# Altium project ArtixDuo.PrjPcb (part 7 of 8)

## Sheet High Speed User IO.SchDoc
size A2; SheetNumber: 12; SheetTotal: 13
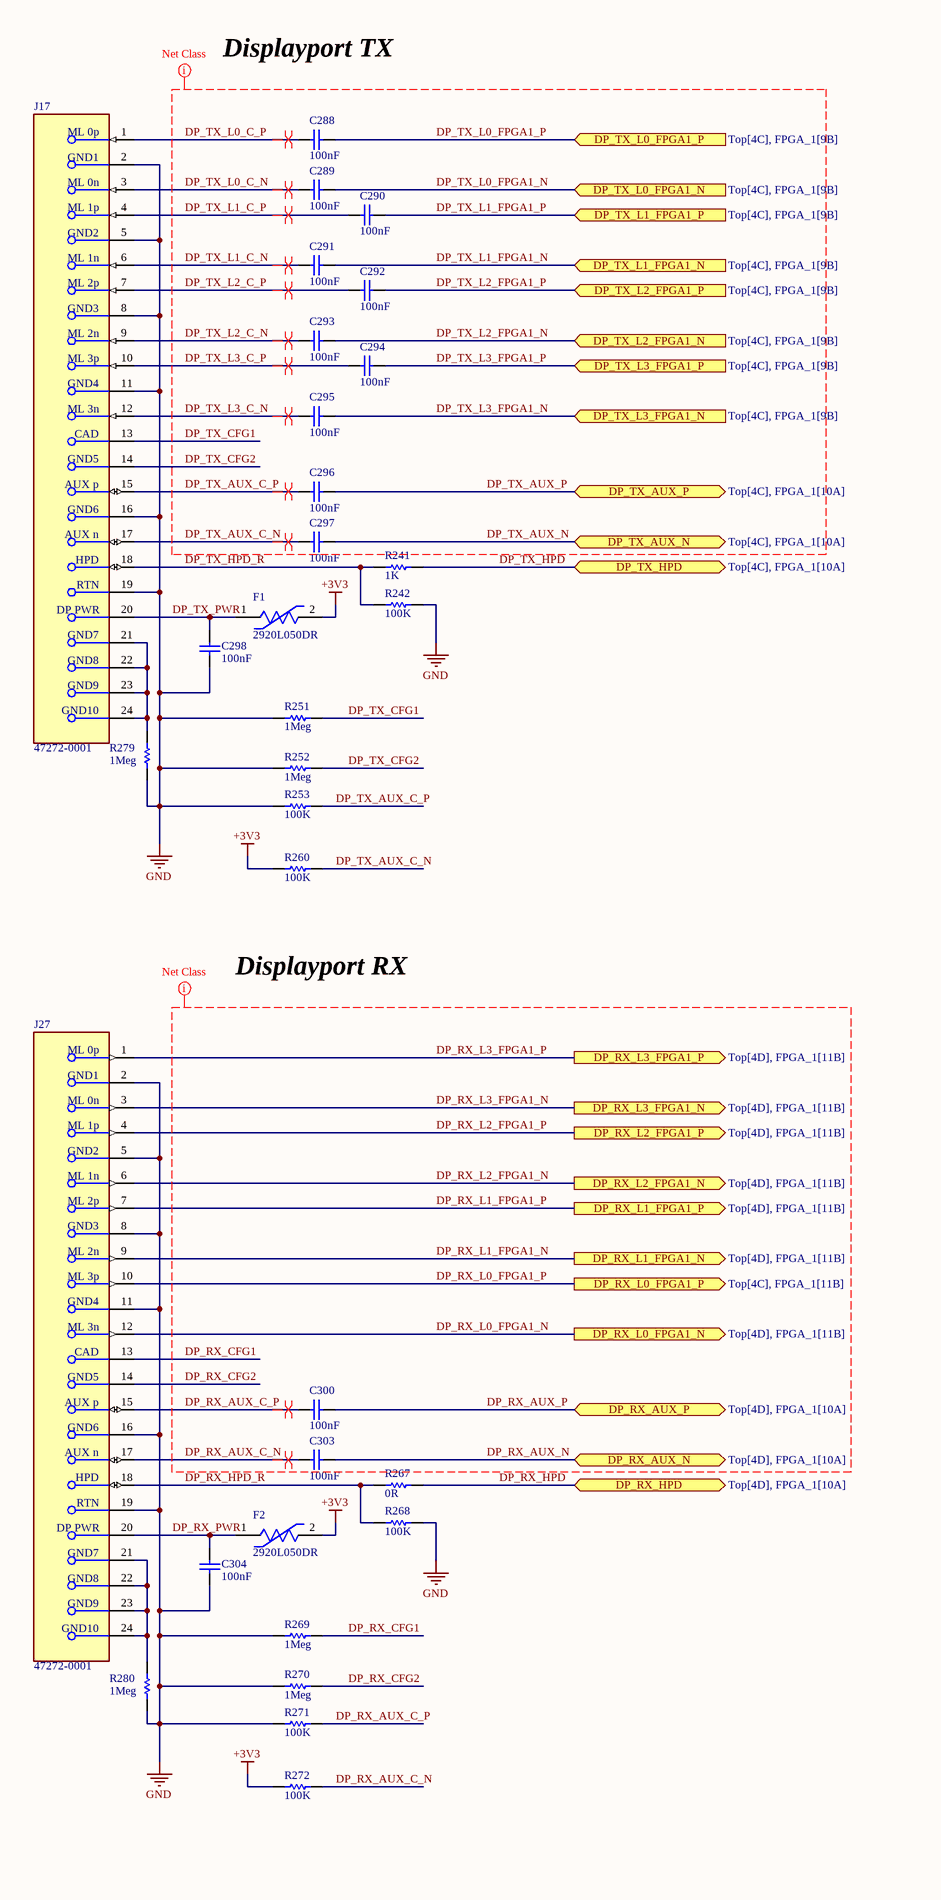
[diagram p26: High Speed User IO.SchDoc, left]
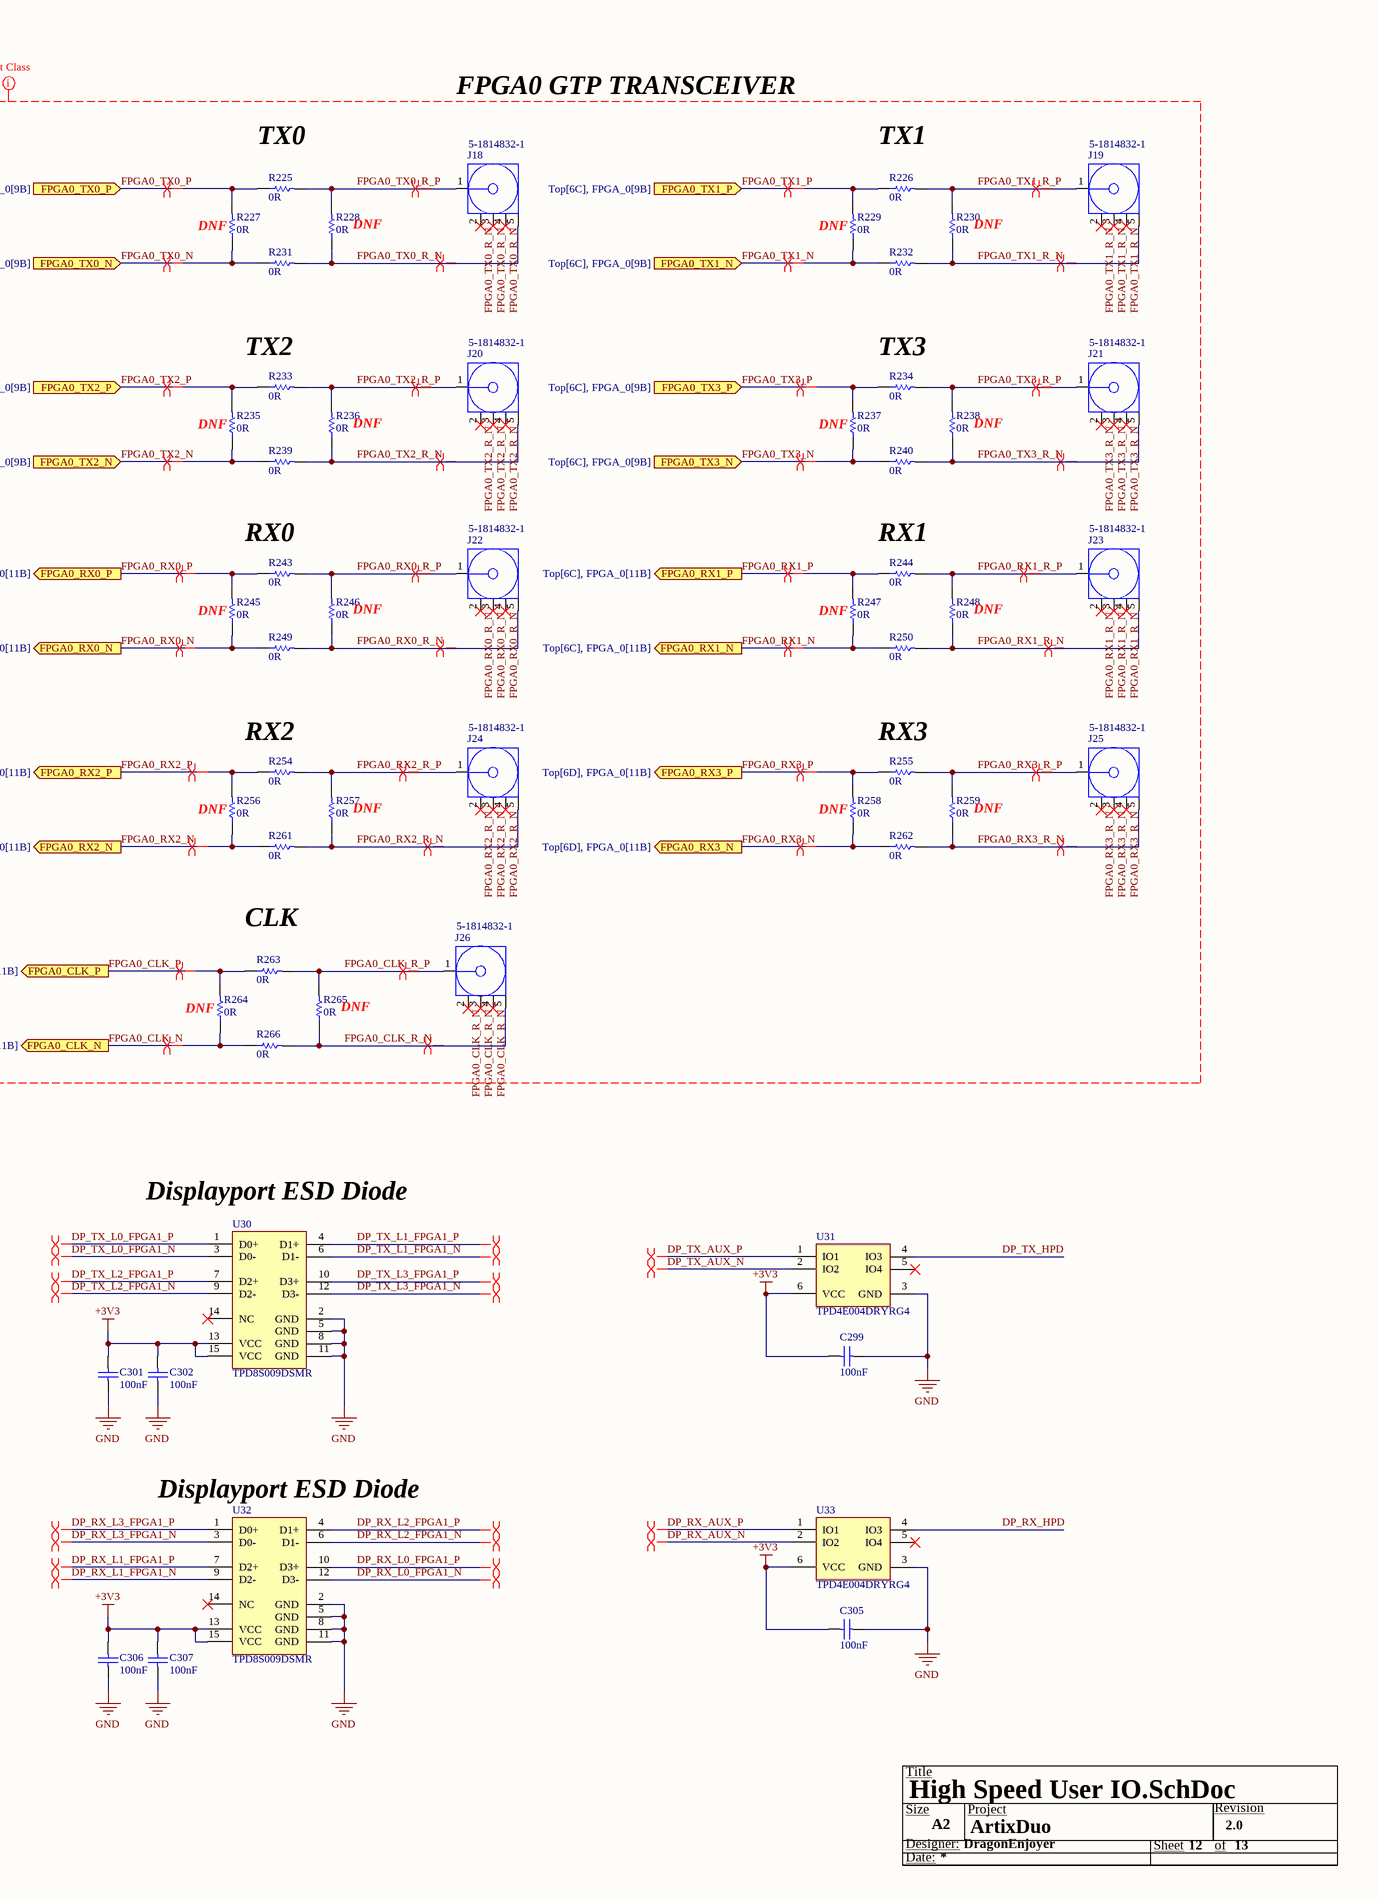
[diagram p27: High Speed User IO.SchDoc, right]

### Parts
(Parts that share a designator on the sheet are numbered #1, #2 ... from top to bottom, then left to right.)
*#10  Size: A2  (hidden comment: Title Block)  (graphical)
C288  100nF  [CAPC1005X05N]
C289  100nF  [CAPC1005X05N]
C290  100nF  [CAPC1005X05N]
C291  100nF  [CAPC1005X05N]
C292  100nF  [CAPC1005X05N]
C293  100nF  [CAPC1005X05N]
C294  100nF  [CAPC1005X05N]
C295  100nF  [CAPC1005X05N]
C296  100nF  [CAPC1005X05N]
C297  100nF  [CAPC1005X05N]
C298  100nF  [CAPC1005X05N]
C299  100nF  [CAPC1005X05N]
C300  100nF  [CAPC1005X05N]
C301  100nF  [CAPC1005X05N]
C302  100nF  [CAPC1005X05N]
C303  100nF  [CAPC1005X05N]
C304  100nF  [CAPC1005X05N]
C305  100nF  [CAPC1005X05N]
C306  100nF  [CAPC1005X05N]
C307  100nF  [CAPC1005X05N]
F1  2920L050DR  [FP-2920L050DR-MFG]
F2  2920L050DR  [FP-2920L050DR-MFG]
J17  47272-0001  [FP-47272-0001-MFG]
J18  5-1814832-1  [TECO-5-1814832-1_V]
J19  5-1814832-1  [TECO-5-1814832-1_V]
J20  5-1814832-1  [TECO-5-1814832-1_V]
J21  5-1814832-1  [TECO-5-1814832-1_V]
J22  5-1814832-1  [TECO-5-1814832-1_V]
J23  5-1814832-1  [TECO-5-1814832-1_V]
J24  5-1814832-1  [TECO-5-1814832-1_V]
J25  5-1814832-1  [TECO-5-1814832-1_V]
J26  5-1814832-1  [TECO-5-1814832-1_V]
J27  47272-0001  [FP-47272-0001-MFG]
R225  0R  [RESC1005X40X25NL05T10]
R226  0R  [RESC1005X40X25NL05T10]
R227  0R  [RESC1005X40X25NL05T10]
R228  0R  [RESC1005X40X25NL05T10]
R229  0R  [RESC1005X40X25NL05T10]
R230  0R  [RESC1005X40X25NL05T10]
R231  0R  [RESC1005X40X25NL05T10]
R232  0R  [RESC1005X40X25NL05T10]
R233  0R  [RESC1005X40X25NL05T10]
R234  0R  [RESC1005X40X25NL05T10]
R235  0R  [RESC1005X40X25NL05T10]
R236  0R  [RESC1005X40X25NL05T10]
R237  0R  [RESC1005X40X25NL05T10]
R238  0R  [RESC1005X40X25NL05T10]
R239  0R  [RESC1005X40X25NL05T10]
R240  0R  [RESC1005X40X25NL05T10]
R241  1K  [RESC1005X40X25NL05T10]
R242  100K  [RESC1005X40X25NL05T05]
R243  0R  [RESC1005X40X25NL05T10]
R244  0R  [RESC1005X40X25NL05T10]
R245  0R  [RESC1005X40X25NL05T10]
R246  0R  [RESC1005X40X25NL05T10]
R247  0R  [RESC1005X40X25NL05T10]
R248  0R  [RESC1005X40X25NL05T10]
R249  0R  [RESC1005X40X25NL05T10]
R250  0R  [RESC1005X40X25NL05T10]
R251  1Meg  [RESC1005X40X25NL05T05]
R252  1Meg  [RESC1005X40X25NL05T05]
R253  100K  [RESC1005X40X25NL05T05]
R254  0R  [RESC1005X40X25NL05T10]
R255  0R  [RESC1005X40X25NL05T10]
R256  0R  [RESC1005X40X25NL05T10]
R257  0R  [RESC1005X40X25NL05T10]
R258  0R  [RESC1005X40X25NL05T10]
R259  0R  [RESC1005X40X25NL05T10]
R260  100K  [RESC1005X40X25NL05T05]
R261  0R  [RESC1005X40X25NL05T10]
R262  0R  [RESC1005X40X25NL05T10]
R263  0R  [RESC1005X40X25NL05T10]
R264  0R  [RESC1005X40X25NL05T10]
R265  0R  [RESC1005X40X25NL05T10]
R266  0R  [RESC1005X40X25NL05T10]
R267  0R  [RESC1005X40X25NL05T10]
R268  100K  [RESC1005X40X25NL05T05]
R269  1Meg  [RESC1005X40X25NL05T05]
R270  1Meg  [RESC1005X40X25NL05T05]
R271  100K  [RESC1005X40X25NL05T05]
R272  100K  [RESC1005X40X25NL05T05]
R279  1Meg  [RESC1005X40X25NL05T05]
R280  1Meg  [RESC1005X40X25NL05T05]
U30  TPD8S009DSMR  [DSM0015A_V]
U31  TPD4E004DRYRG4  [DRY0006A]
U32  TPD8S009DSMR  [DSM0015A_V]
U33  TPD4E004DRYRG4  [DRY0006A]

### Ports
DP_RX_AUX_N (bidir, see Top[4D], FPGA_1[10A]), DP_RX_AUX_P (bidir, see Top[4D], FPGA_1[10A]), DP_RX_HPD (bidir, see Top[4D], FPGA_1[10A]), DP_RX_L0_FPGA1_N (out, see Top[4D], FPGA_1[11B]), DP_RX_L0_FPGA1_P (out, see Top[4C], FPGA_1[11B]), DP_RX_L1_FPGA1_N (out, see Top[4D], FPGA_1[11B]), DP_RX_L1_FPGA1_P (out, see Top[4D], FPGA_1[11B]), DP_RX_L2_FPGA1_N (out, see Top[4D], FPGA_1[11B]), DP_RX_L2_FPGA1_P (out, see Top[4D], FPGA_1[11B]), DP_RX_L3_FPGA1_N (out, see Top[4D], FPGA_1[11B]), DP_RX_L3_FPGA1_P (out, see Top[4D], FPGA_1[11B]), DP_TX_AUX_N (bidir, see Top[4C], FPGA_1[10A]), DP_TX_AUX_P (bidir, see Top[4C], FPGA_1[10A]), DP_TX_HPD (bidir, see Top[4C], FPGA_1[10A]), DP_TX_L0_FPGA1_N (in, see Top[4C], FPGA_1[9B]), DP_TX_L0_FPGA1_P (in, see Top[4C], FPGA_1[9B]), DP_TX_L1_FPGA1_N (in, see Top[4C], FPGA_1[9B]), DP_TX_L1_FPGA1_P (in, see Top[4C], FPGA_1[9B]), DP_TX_L2_FPGA1_N (in, see Top[4C], FPGA_1[9B]), DP_TX_L2_FPGA1_P (in, see Top[4C], FPGA_1[9B]), DP_TX_L3_FPGA1_N (in, see Top[4C], FPGA_1[9B]), DP_TX_L3_FPGA1_P (in, see Top[4C], FPGA_1[9B]), FPGA0_CLK_N (out, see Top[6D], FPGA_0[11B]), FPGA0_CLK_P (out, see Top[6D], FPGA_0[11B]), FPGA0_RX0_N (out, see Top[6C], FPGA_0[11B]), FPGA0_RX0_P (out, see Top[6C], FPGA_0[11B]), FPGA0_RX1_N (out, see Top[6C], FPGA_0[11B]), FPGA0_RX1_P (out, see Top[6C], FPGA_0[11B]), FPGA0_RX2_N (out, see Top[6D], FPGA_0[11B]), FPGA0_RX2_P (out, see Top[6C], FPGA_0[11B]), FPGA0_RX3_N (out, see Top[6D], FPGA_0[11B]), FPGA0_RX3_P (out, see Top[6D], FPGA_0[11B]), FPGA0_TX0_N (in, see Top[6C], FPGA_0[9B]), FPGA0_TX0_P (in, see Top[6C], FPGA_0[9B]), FPGA0_TX1_N (in, see Top[6C], FPGA_0[9B]), FPGA0_TX1_P (in, see Top[6C], FPGA_0[9B]), FPGA0_TX2_N (in, see Top[6C], FPGA_0[9B]), FPGA0_TX2_P (in, see Top[6C], FPGA_0[9B]), FPGA0_TX3_N (in, see Top[6C], FPGA_0[9B]), FPGA0_TX3_P (in, see Top[6C], FPGA_0[9B])

### Nets
+3V3: C299.1 C301.1 C302.1 C305.1 C306.1 C307.1 F1.2 F2.2 R260.1 R272.1 U30.13(VCC) U30.15(VCC) U31.6(VCC) U32.13(VCC) U32.15(VCC) U33.6(VCC)
GND: C298.2 C299.2 C301.2 C302.2 C304.2 C305.2 C306.2 C307.2 J17.2(GND1) J17.5(GND2) J17.8(GND3) J17.11(GND4) J17.16(GND6) J17.19(RTN) J27.2(GND1) J27.5(GND2) J27.8(GND3) J27.11(GND4) J27.16(GND6) J27.19(RTN) R242.2 R251.1 R252.1 R253.1 R268.2 R269.1 R270.1 R271.1 R279.2 R280.1 U30.2(GND) U30.5(GND) U30.8(GND) U30.11(GND) U31.3(GND) U32.2(GND) U32.5(GND) U32.8(GND) U32.11(GND) U33.3(GND)
DP_RX_AUX_C_N: C303.2 J27.17(AUX_n) R272.2
DP_RX_AUX_C_P: C300.2 J27.15(AUX_p) R271.2
DP_RX_AUX_N: C303.1 U33.2(IO2) ; port DP_RX_AUX_N
DP_RX_AUX_P: C300.1 U33.1(IO1) ; port DP_RX_AUX_P
DP_RX_CFG1: J27.13(CAD) R269.2
DP_RX_CFG2: J27.14(GND5) R270.2
DP_RX_HPD: R267.2 U33.4(IO3) ; port DP_RX_HPD
DP_RX_HPD_R: J27.18(HPD) R267.1 R268.1
DP_RX_L0_FPGA1_N: J27.12(ML_3n) U32.12(D3-) ; port DP_RX_L0_FPGA1_N
DP_RX_L0_FPGA1_P: J27.10(ML_3p) U32.10(D3+) ; port DP_RX_L0_FPGA1_P
DP_RX_L1_FPGA1_N: J27.9(ML_2n) U32.9(D2-) ; port DP_RX_L1_FPGA1_N
DP_RX_L1_FPGA1_P: J27.7(ML_2p) U32.7(D2+) ; port DP_RX_L1_FPGA1_P
DP_RX_L2_FPGA1_N: J27.6(ML_1n) U32.6(D1-) ; port DP_RX_L2_FPGA1_N
DP_RX_L2_FPGA1_P: J27.4(ML_1p) U32.4(D1+) ; port DP_RX_L2_FPGA1_P
DP_RX_L3_FPGA1_N: J27.3(ML_0n) U32.3(D0-) ; port DP_RX_L3_FPGA1_N
DP_RX_L3_FPGA1_P: J27.1(ML_0p) U32.1(D0+) ; port DP_RX_L3_FPGA1_P
DP_RX_PWR: C304.1 F2.1 J27.20(DP_PWR)
DP_TX_AUX_C_N: C297.2 J17.17(AUX_n) R260.2
DP_TX_AUX_C_P: C296.2 J17.15(AUX_p) R253.2
DP_TX_AUX_N: C297.1 U31.2(IO2) ; port DP_TX_AUX_N
DP_TX_AUX_P: C296.1 U31.1(IO1) ; port DP_TX_AUX_P
DP_TX_CFG1: J17.13(CAD) R251.2
DP_TX_CFG2: J17.14(GND5) R252.2
DP_TX_HPD: R241.2 U31.4(IO3) ; port DP_TX_HPD
DP_TX_HPD_R: J17.18(HPD) R241.1 R242.1
DP_TX_L0_C_N: C289.2 J17.3(ML_0n)
DP_TX_L0_C_P: C288.2 J17.1(ML_0p)
DP_TX_L0_FPGA1_N: C289.1 U30.3(D0-) ; port DP_TX_L0_FPGA1_N
DP_TX_L0_FPGA1_P: C288.1 U30.1(D0+) ; port DP_TX_L0_FPGA1_P
DP_TX_L1_C_N: C291.2 J17.6(ML_1n)
DP_TX_L1_C_P: C290.2 J17.4(ML_1p)
DP_TX_L1_FPGA1_N: C291.1 U30.6(D1-) ; port DP_TX_L1_FPGA1_N
DP_TX_L1_FPGA1_P: C290.1 U30.4(D1+) ; port DP_TX_L1_FPGA1_P
DP_TX_L2_C_N: C293.2 J17.9(ML_2n)
DP_TX_L2_C_P: C292.2 J17.7(ML_2p)
DP_TX_L2_FPGA1_N: C293.1 U30.9(D2-) ; port DP_TX_L2_FPGA1_N
DP_TX_L2_FPGA1_P: C292.1 U30.7(D2+) ; port DP_TX_L2_FPGA1_P
DP_TX_L3_C_N: C295.2 J17.12(ML_3n)
DP_TX_L3_C_P: C294.2 J17.10(ML_3p)
DP_TX_L3_FPGA1_N: C295.1 U30.12(D3-) ; port DP_TX_L3_FPGA1_N
DP_TX_L3_FPGA1_P: C294.1 U30.10(D3+) ; port DP_TX_L3_FPGA1_P
DP_TX_PWR: C298.1 F1.1 J17.20(DP_PWR)
FPGA0_CLK_N: R264.1 R266.1 ; port FPGA0_CLK_N
FPGA0_CLK_P: R263.1 R264.2 ; port FPGA0_CLK_P
FPGA0_CLK_R_N: J26.2 J26.3 J26.4 J26.5 R265.1 R266.2
FPGA0_CLK_R_P: J26.1 R263.2 R265.2
FPGA0_RX0_N: R245.1 R249.1 ; port FPGA0_RX0_N
FPGA0_RX0_P: R243.1 R245.2 ; port FPGA0_RX0_P
FPGA0_RX0_R_N: J22.2 J22.3 J22.4 J22.5 R246.1 R249.2
FPGA0_RX0_R_P: J22.1 R243.2 R246.2
FPGA0_RX1_N: R247.1 R250.1 ; port FPGA0_RX1_N
FPGA0_RX1_P: R244.1 R247.2 ; port FPGA0_RX1_P
FPGA0_RX1_R_N: J23.2 J23.3 J23.4 J23.5 R248.1 R250.2
FPGA0_RX1_R_P: J23.1 R244.2 R248.2
FPGA0_RX2_N: R256.1 R261.1 ; port FPGA0_RX2_N
FPGA0_RX2_P: R254.1 R256.2 ; port FPGA0_RX2_P
FPGA0_RX2_R_N: J24.2 J24.3 J24.4 J24.5 R257.1 R261.2
FPGA0_RX2_R_P: J24.1 R254.2 R257.2
FPGA0_RX3_N: R258.1 R262.1 ; port FPGA0_RX3_N
FPGA0_RX3_P: R255.1 R258.2 ; port FPGA0_RX3_P
FPGA0_RX3_R_N: J25.2 J25.3 J25.4 J25.5 R259.1 R262.2
FPGA0_RX3_R_P: J25.1 R255.2 R259.2
FPGA0_TX0_N: R227.1 R231.1 ; port FPGA0_TX0_N
FPGA0_TX0_P: R225.1 R227.2 ; port FPGA0_TX0_P
FPGA0_TX0_R_N: J18.2 J18.3 J18.4 J18.5 R228.1 R231.2
FPGA0_TX0_R_P: J18.1 R225.2 R228.2
FPGA0_TX1_N: R229.1 R232.1 ; port FPGA0_TX1_N
FPGA0_TX1_P: R226.1 R229.2 ; port FPGA0_TX1_P
FPGA0_TX1_R_N: J19.2 J19.3 J19.4 J19.5 R230.1 R232.2
FPGA0_TX1_R_P: J19.1 R226.2 R230.2
FPGA0_TX2_N: R235.1 R239.1 ; port FPGA0_TX2_N
FPGA0_TX2_P: R233.1 R235.2 ; port FPGA0_TX2_P
FPGA0_TX2_R_N: J20.2 J20.3 J20.4 J20.5 R236.1 R239.2
FPGA0_TX2_R_P: J20.1 R233.2 R236.2
FPGA0_TX3_N: R237.1 R240.1 ; port FPGA0_TX3_N
FPGA0_TX3_P: R234.1 R237.2 ; port FPGA0_TX3_P
FPGA0_TX3_R_N: J21.2 J21.3 J21.4 J21.5 R238.1 R240.2
FPGA0_TX3_R_P: J21.1 R234.2 R238.2
NetJ17_21: J17.21(GND7) J17.22(GND8) J17.23(GND9) J17.24(GND10) R279.1
NetJ27_21: J27.21(GND7) J27.22(GND8) J27.23(GND9) J27.24(GND10) R280.2

Not connected (* = marked no-connect by the designer): U30 14(NC)*; U31 5(IO4)*; U32 14(NC)*; U33 5(IO4)*

### Layout directives
net class FPGA1 DP RX: DP_RX_AUX_C_N, DP_RX_AUX_C_P, DP_RX_AUX_N, DP_RX_AUX_P, DP_RX_CFG1, DP_RX_CFG2, DP_RX_L0_FPGA1_N, DP_RX_L0_FPGA1_P, DP_RX_L1_FPGA1_N, DP_RX_L1_FPGA1_P, DP_RX_L2_FPGA1_N, DP_RX_L2_FPGA1_P, DP_RX_L3_FPGA1_N, DP_RX_L3_FPGA1_P
net class FPGA1 DP TX: DP_TX_AUX_C_N, DP_TX_AUX_C_P, DP_TX_AUX_N, DP_TX_AUX_P, DP_TX_CFG1, DP_TX_CFG2, DP_TX_L0_C_N, DP_TX_L0_C_P, DP_TX_L0_FPGA1_N, DP_TX_L0_FPGA1_P, DP_TX_L1_C_N, DP_TX_L1_C_P, DP_TX_L1_FPGA1_N, DP_TX_L1_FPGA1_P, DP_TX_L2_C_N, DP_TX_L2_C_P, DP_TX_L2_FPGA1_N, DP_TX_L2_FPGA1_P, DP_TX_L3_C_N, DP_TX_L3_C_P, DP_TX_L3_FPGA1_N, DP_TX_L3_FPGA1_P
net class FPGA1 GPT TRANSCEIVERS: FPGA0_CLK_N, FPGA0_CLK_P, FPGA0_CLK_R_N, FPGA0_CLK_R_P, FPGA0_RX0_N, FPGA0_RX0_P, FPGA0_RX0_R_N, FPGA0_RX0_R_P, FPGA0_RX1_N, FPGA0_RX1_P, FPGA0_RX1_R_N, FPGA0_RX1_R_P, FPGA0_RX2_N, FPGA0_RX2_P, FPGA0_RX2_R_N, FPGA0_RX2_R_P, FPGA0_RX3_N, FPGA0_RX3_P, FPGA0_RX3_R_N, FPGA0_RX3_R_P, FPGA0_TX0_N, FPGA0_TX0_P, FPGA0_TX0_R_N, FPGA0_TX0_R_P, FPGA0_TX1_N, FPGA0_TX1_P, FPGA0_TX1_R_N, FPGA0_TX1_R_P, FPGA0_TX2_N, FPGA0_TX2_P, FPGA0_TX2_R_N, FPGA0_TX2_R_P, FPGA0_TX3_N, FPGA0_TX3_P, FPGA0_TX3_R_N, FPGA0_TX3_R_P
differential pair: DP_RX_AUX_C_N, DP_RX_AUX_C_P, DP_RX_AUX_N, DP_RX_AUX_P, DP_RX_L0_FPGA1_N, DP_RX_L0_FPGA1_P, DP_RX_L1_FPGA1_N, DP_RX_L1_FPGA1_P, DP_RX_L2_FPGA1_N, DP_RX_L2_FPGA1_P, DP_RX_L3_FPGA1_N, DP_RX_L3_FPGA1_P, DP_TX_AUX_C_N, DP_TX_AUX_C_P, DP_TX_AUX_N, DP_TX_AUX_P, DP_TX_L0_C_N, DP_TX_L0_C_P, DP_TX_L0_FPGA1_N, DP_TX_L0_FPGA1_P, DP_TX_L1_C_N, DP_TX_L1_C_P, DP_TX_L1_FPGA1_N, DP_TX_L1_FPGA1_P, DP_TX_L2_C_N, DP_TX_L2_C_P, DP_TX_L2_FPGA1_N, DP_TX_L2_FPGA1_P, DP_TX_L3_C_N, DP_TX_L3_C_P, DP_TX_L3_FPGA1_N, DP_TX_L3_FPGA1_P, FPGA0_CLK_N, FPGA0_CLK_P, FPGA0_CLK_R_N, FPGA0_CLK_R_P, FPGA0_RX0_N, FPGA0_RX0_P, FPGA0_RX0_R_N, FPGA0_RX0_R_P, FPGA0_RX1_N, FPGA0_RX1_P, FPGA0_RX1_R_N, FPGA0_RX1_R_P, FPGA0_RX2_N, FPGA0_RX2_P, FPGA0_RX2_R_N, FPGA0_RX2_R_P, FPGA0_RX3_N, FPGA0_RX3_P, FPGA0_RX3_R_N, FPGA0_RX3_R_P, FPGA0_TX0_N, FPGA0_TX0_P, FPGA0_TX0_R_N, FPGA0_TX0_R_P, FPGA0_TX1_N, FPGA0_TX1_P, FPGA0_TX1_R_N, FPGA0_TX1_R_P, FPGA0_TX2_N, FPGA0_TX2_P, FPGA0_TX2_R_N, FPGA0_TX2_R_P, FPGA0_TX3_N, FPGA0_TX3_P, FPGA0_TX3_R_N, FPGA0_TX3_R_P

### Notes on the sheet
- Displayport TX
- FPGA0 GTP TRANSCEIVER
- (near R225) TX0
- (near R226) TX1
- (near R227) DNF
- (near R228) DNF
- (near R229) DNF
- (near R230) DNF
- (near R233) TX2
- (near R234) TX3
- (near R235) DNF
- (near R236) DNF
- (near R237) DNF
- (near R238) DNF
- (near R243) RX0
- (near R244) RX1
- (near R245) DNF
- (near R246) DNF
- (near R247) DNF
- (near R248) DNF
- (near R254) RX2
- (near R255) RX3
- (near R256) DNF
- (near R257) DNF
- (near R258) DNF
- (near R259) DNF
- CLK
- Displayport RX
- (near R264) DNF
- (near R265) DNF
- (near U30) Displayport ESD Diode
- (near U32) Displayport ESD Diode
- (in symbol CMP-007-000006-8) Title; Size; Project; Revision; Designer:; Sheet; of; Date:

### Library data of the parts
*#10 = CMP-007-000006-8: Generic Title Block
C288-C307 = CMP-001-00095-1: Cap Ceramic 0.1uF 50V X7R 20% SMD 0402 125°C Paper T/R GRM155R71H104ME14J; Voltage: 50V; Capacitance: 100nF; Case: 0402
F1 F2 = CMP-08606-000071-1: PTC RESET FUSE 60V 500MA 2920; Resistance: 1.4R; Trip Current: 1A; Power Dissipation: 1.5W; Time to Trip: 4s; Approvals: cULus; Current Rating: 10A; Operating Supply Voltage: 60V; Termination: SMD/SMT; Width: 5.44mm; Case/Package: 2920; Series: 2920L; Case Code (Imperial): 2920; Height: 1.25mm; Hold Current: 500mA; Terminal Material: Copper; Min Operating Temperature: -40°C; Package Quantity: 1500; Max Voltage Rating (DC): 60V; RoHS Compliant: Yes; Case Code (Metric): 7351; Lead Free: Lead Free; Max Operating Temperature: 85°C; Voltage Rating (DC): 60V; Working Voltage: 60V; Length: 7.98mm; REACH SVHC: No SVHC; Max Current Rating: 10A; Voltage Rating: 60V; Packaging: Tape and Reel
J17 J27 = CMP-2000-05608-2: CONN RCPT DISPLAYPORT 20P SMD RA; Manufacturer: Molex; Voltage Rating: 40V; Is Female: yes; Shielding: true; Number Of Contacts: 20; Conn Orientation: Right Angle; Current Rating: 0.5A; Pitch: 0.5mm; Device Class L2: Audio / Video Connectors; Temperature: -20°C to +85°C; Contact Material: Gold,Nickel; Footprint Url: https://www.molex.com/pdm_docs/sd/472720001_sd.pdf; Device Class L1: Connectors; ComponentLink2Description: Datasheet; Temperature Range Low: -20°C; Automotive: No; Package: 0; Height: 6.9mm; RoHS: TRUE; Octopart: https://octopart.com/47272-0001-molex-5441289; Lead Free: Yes; ComponentLink2URL: https://www.molex.com/webdocs/datasheets/pdf/en-us/0472720001_IO_CONNECTORS.pdf; Device Class L3: unset; Mouser Description: HDMI, Displayport & DVI Connectors .5MM RA SMT RCPT; Category: Conn; Manufacturer Part Number: 47272-0001; Digikey Description: CONN RCPT DISPLAYPORT 20P SMD RA; Temperature Range High: +85°C
J18-J26 = CMP-2000-05415-1: SMA Connector, Pitch 5.08 mm, 1 Position, Height 9.5 mm, Tail Length 4 mm, -65 to 165 degC, RoHS, Bulk; Manufacturer: TE Connectivity; Connector Mounting: PCBMount; Connector Body Style: StraightJack; Impedance: 50ohm; Coaxial Termination: Solder; SVHC: NoSVHC(15-Jun-2015); Frequency Max: 3GHz; Product Range: ZDCSeries; Connector Type: SMACoaxial; Datasheet Version: Rev. B1, 03/2011; Package Reference: 5-1814832-1; Package Description: SMA Connector, Pitch 5.08 mm, 1 Position, Height 9.5 mm, Tail Length 4 mm; Contact Plating: GoldPlatedContacts; Coaxial Cable Types: -; Contact Material: BerylliumCopper; Manufacturer URL: http://www.te.com/; Datasheet URL: http://www.onlinecomponents.com/productFiles/mf-AMP/eng_cd_1814832_a.pdf
R225-R240 R243-R250 R254-R259 R261-R267 = CMP-2002-03041-1: CRCW04020000Z0EDHP; Manufacturer: Vishay Dale; Part Number: CRCW04020000Z0EDHP
R241 = CMP-2002-03045-1: CRCW04021K00FKEDHP; Manufacturer: Vishay Dale; Part Number: CRCW04021K00FKEDHP
R242 R253 R260 R268 R271 R272 = CMP-2002-08125-1: CRCW0402100KJNED; Manufacturer: Vishay Dale; Part Number: CRCW0402100KJNED
R251 R252 R269 R270 R279 R280 = CMP-1011-00146-2: ERJ-2GEJ105X; Manufacturer: Panasonic; Part Number: ERJ-2GEJ105X
U30 U32 = CMP-0326-00039-2: ESD Solution for HDMI / DisplayPort, 8 Channels, -40 to +85 degC, 15-pin SON (DSM); Manufacturer: Texas Instruments; IEC 61000-4-2 Contact(+/- kV): 8; IO Leakage Current(nA): 10; Breakdown Voltage(Min)(V): 9; Differential Capacitance(pF): 0.05; IO Capacitance(Typ)(pF): 0.8; Eco-Plan: TBD; PartNumber: TPD8S009DSMR; ComponentLink3URL: SamplesURL:http://www.ti.com/product/tpd8s009#samples; ComponentLink2URL: http://www.ti.com/general/docs/lit/getliterature.tsp?genericPartNumber=TPD8S009&fileType=pdf; PackageDescription: 15-Pin Plastic Small Outline Flat No-Lead, 2.5 x 6.5 x 0.8 mm Body, 0.5/1.5 mm Pitch; ComponentLink3Description: URL Link1; ComponentLink1Description: Manufacturer URL; DatasheetVersion: SLVS816; ComponentLink1URL: http://www.ti.com/; PackageReference: DSM0015A; IEC 61000-4-2 Air-Gap(+/- kV): 9; Mounting Technology: Surface Mount; ComponentLink2Description: Datasheet; PackageVersion: revA, Aug-2007; SubFamily: ESD Solution
U31 U33 = CMP-0326-00023-2: ESD-Protection Array for High-Speed Data Interfaces, 4 Channels, -40 to +85 degC, 6-pin SON (DRY), Green (RoHS & no Sb/Br); Manufacturer: Texas Instruments; Serial ATA / eSATA: TRUE; IO Leakage Current(nA): 1; IEC 61000-4-2 Air-Gap(+/- kV): 12; Breakdown Voltage(Min)(V): 6; IEC 61000-4-2 Contact(+/- kV): 8; IO Capacitance(Typ)(pF): 1.6; SubFamily: ESD Solution; ComponentLink1Description: Manufacturer URL; ComponentLink2URL: http://www.ti.com/general/docs/lit/getliterature.tsp?genericPartNumber=TPD4E004&fileType=pdf; PartNumber: TPD4E004DRYRG4; 1394 / Firewire: TRUE; DatasheetVersion: SLVS729A; PackageReference: DRY0006A; ComponentLink1URL: http://www.ti.com/; Eco-Plan: Green (RoHS & no Sb/Br); ComponentLink3Description: URL Link1; ComponentLink2Description: Datasheet; USB High Speed: TRUE; Mounting Technology: Surface Mount; PackageDescription: 6-Pin Plastic Small Outline No-Lead, 1 x 1.45 x 0.6 mm Body, 0.5 mm Pitch; PackageVersion: revF, Dec-2011; ComponentLink3URL: SamplesURL:http://www.ti.com/product/tpd4e004#samples

## Sheet User IO Buffers.SchDoc
size A1; SheetNumber: 13; SheetTotal: 13
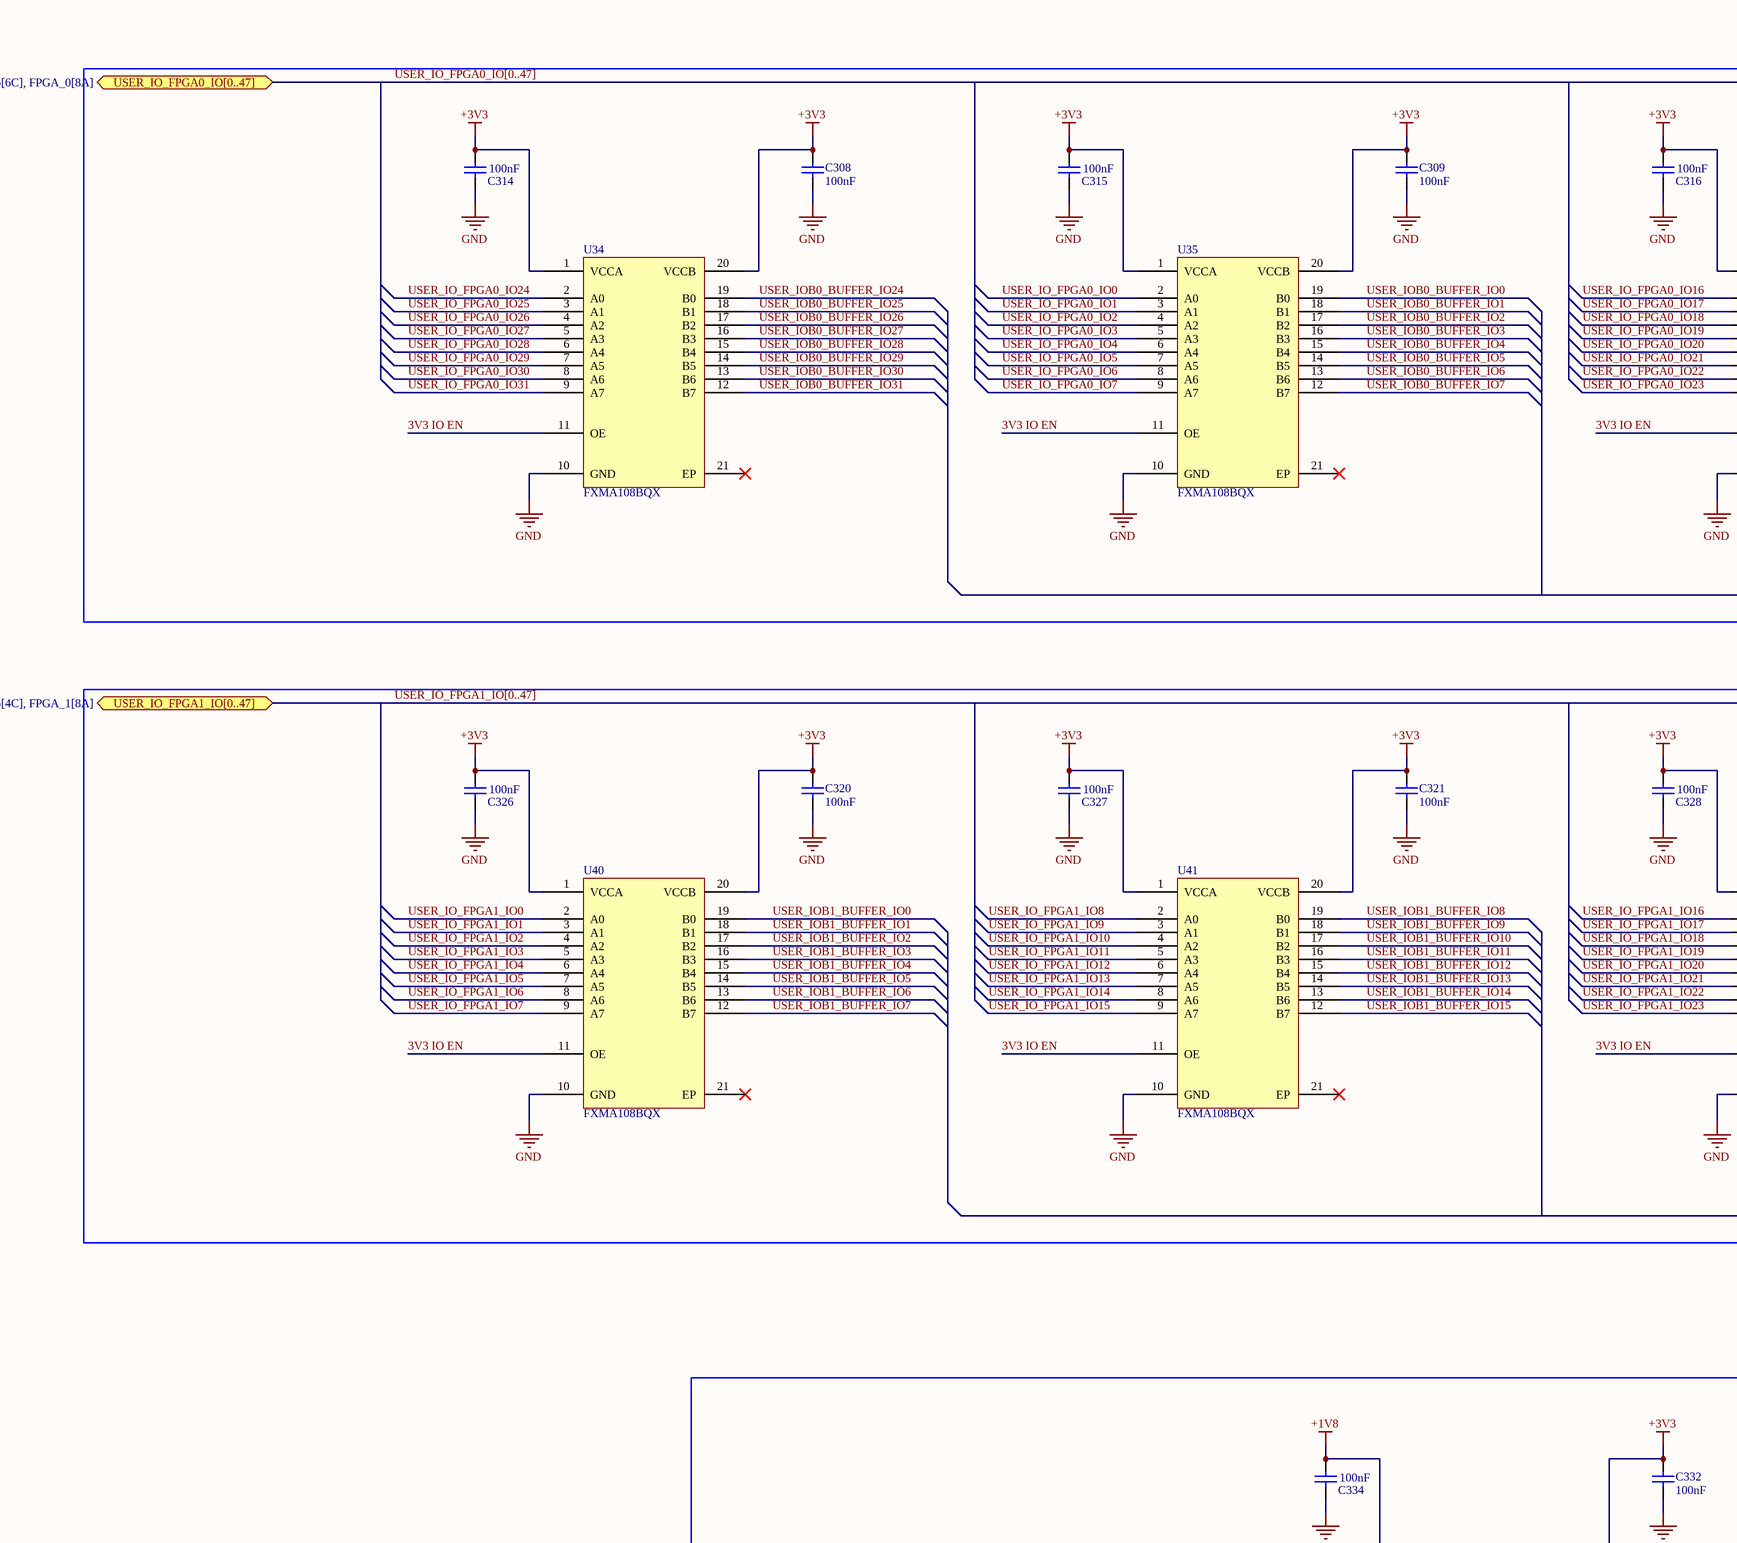
[diagram p28: User IO Buffers.SchDoc, top left]
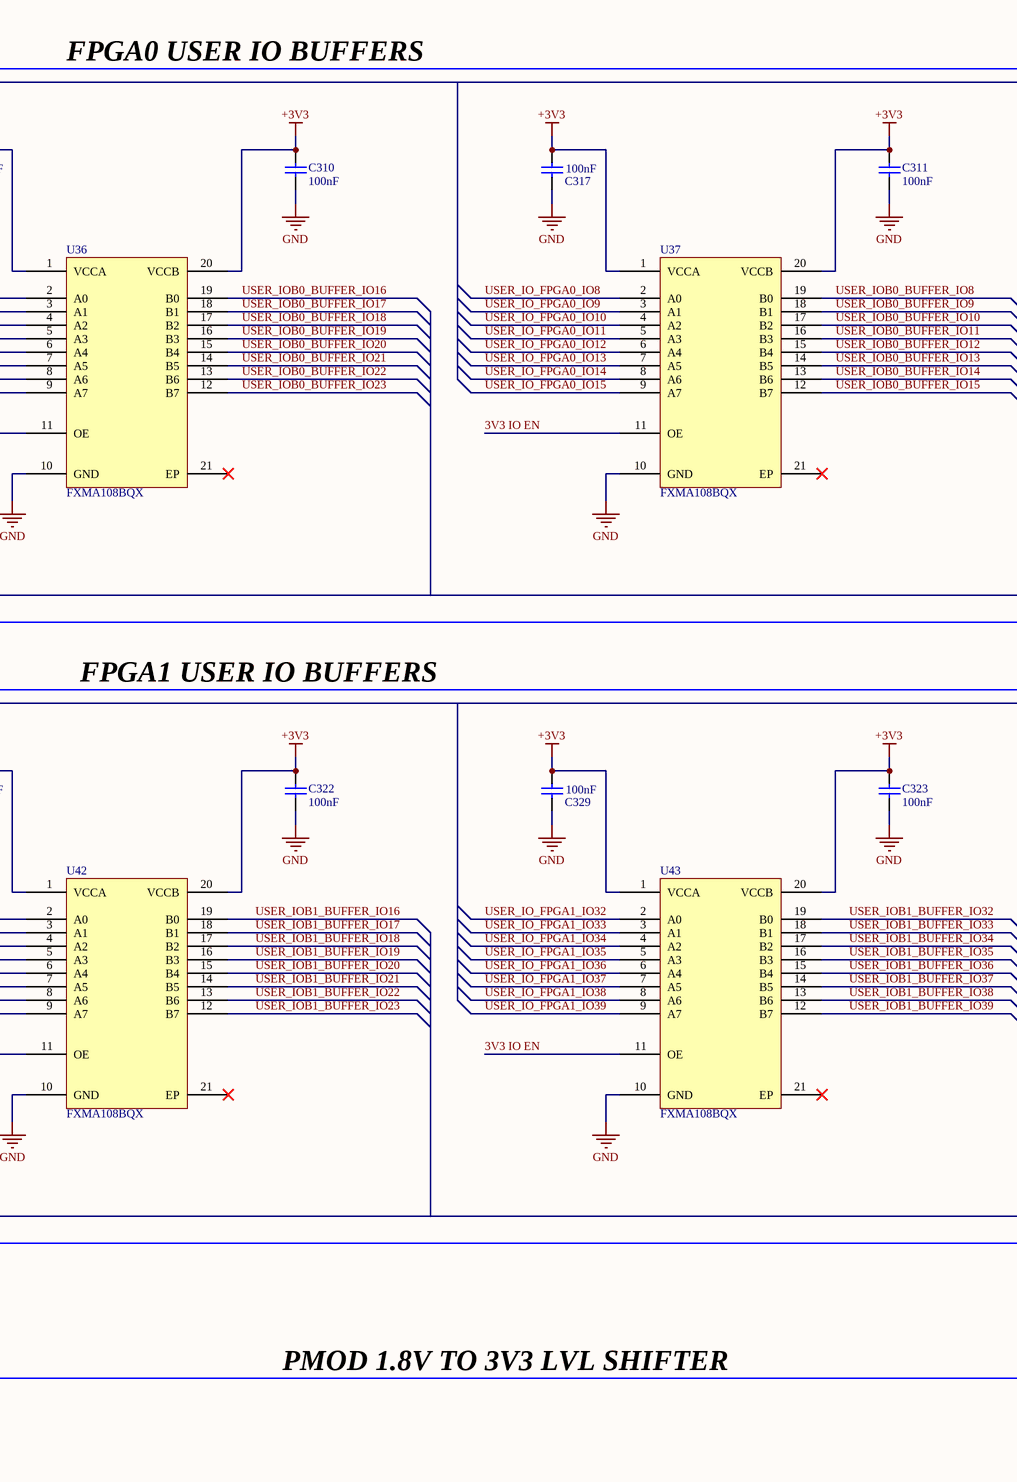
[diagram p29: User IO Buffers.SchDoc, top middle]
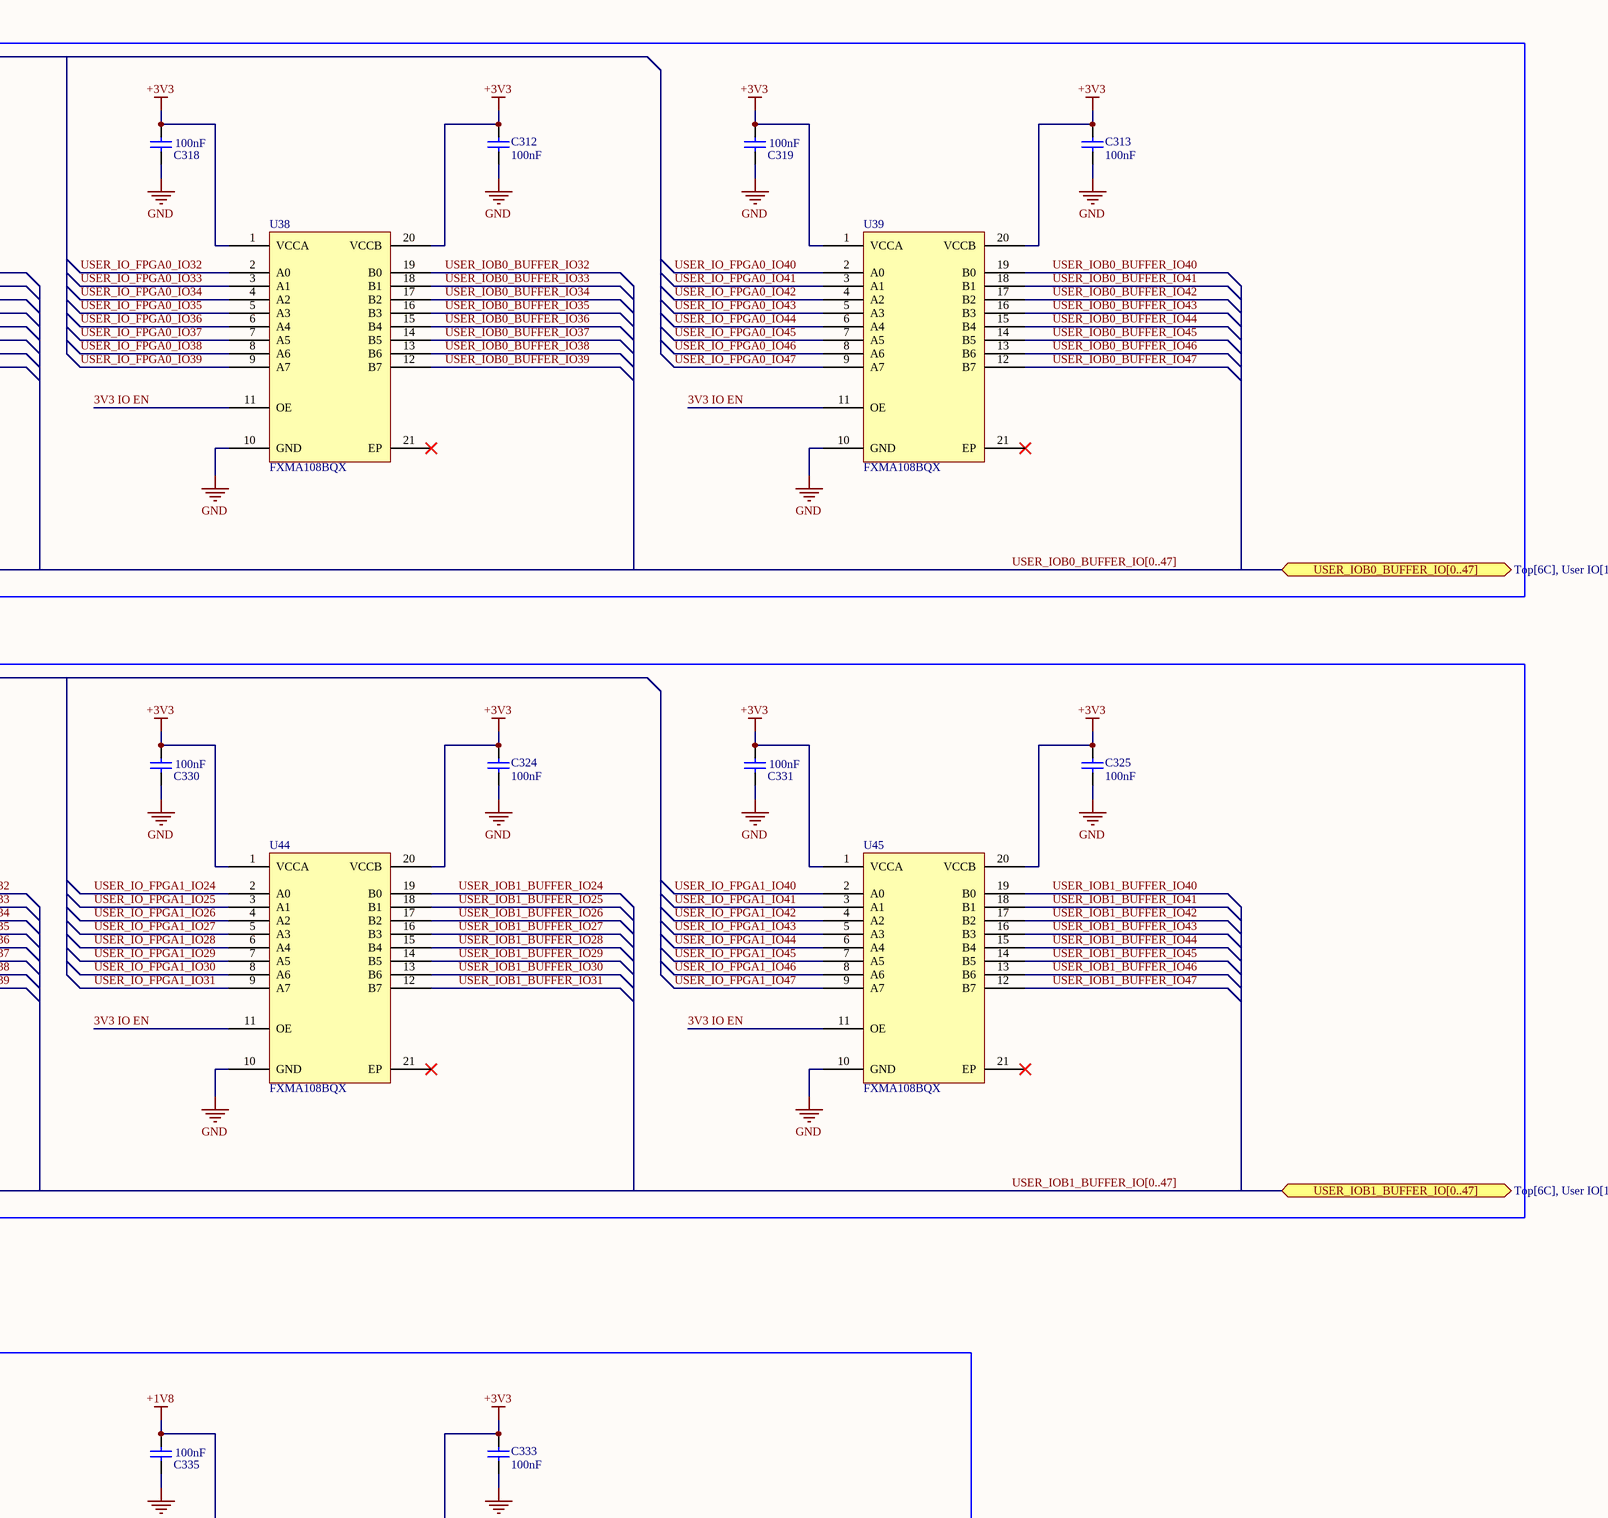
[diagram p30: User IO Buffers.SchDoc, top right]
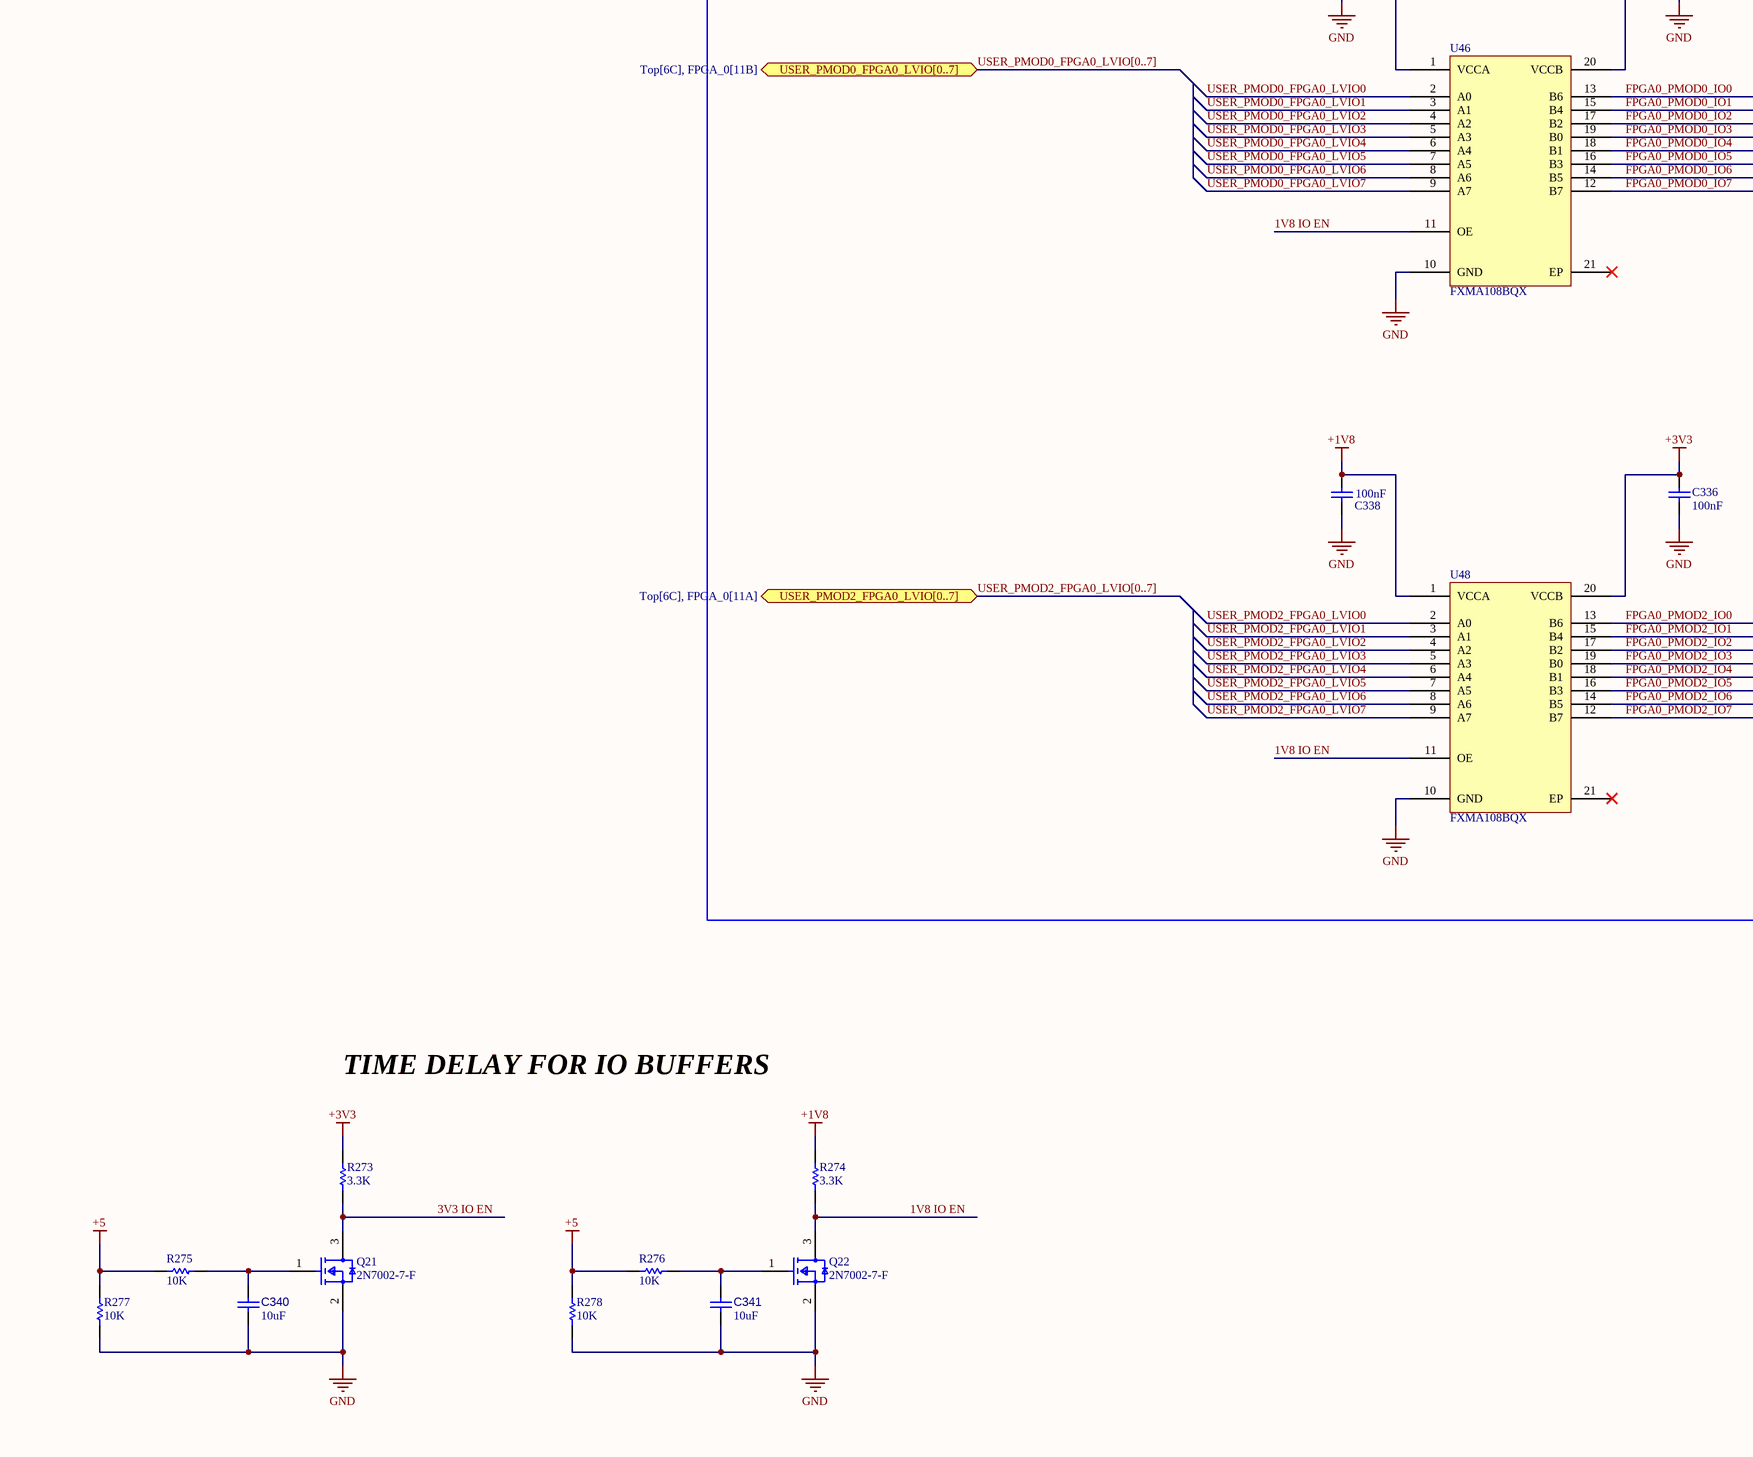
[diagram p31: User IO Buffers.SchDoc, bottom left]
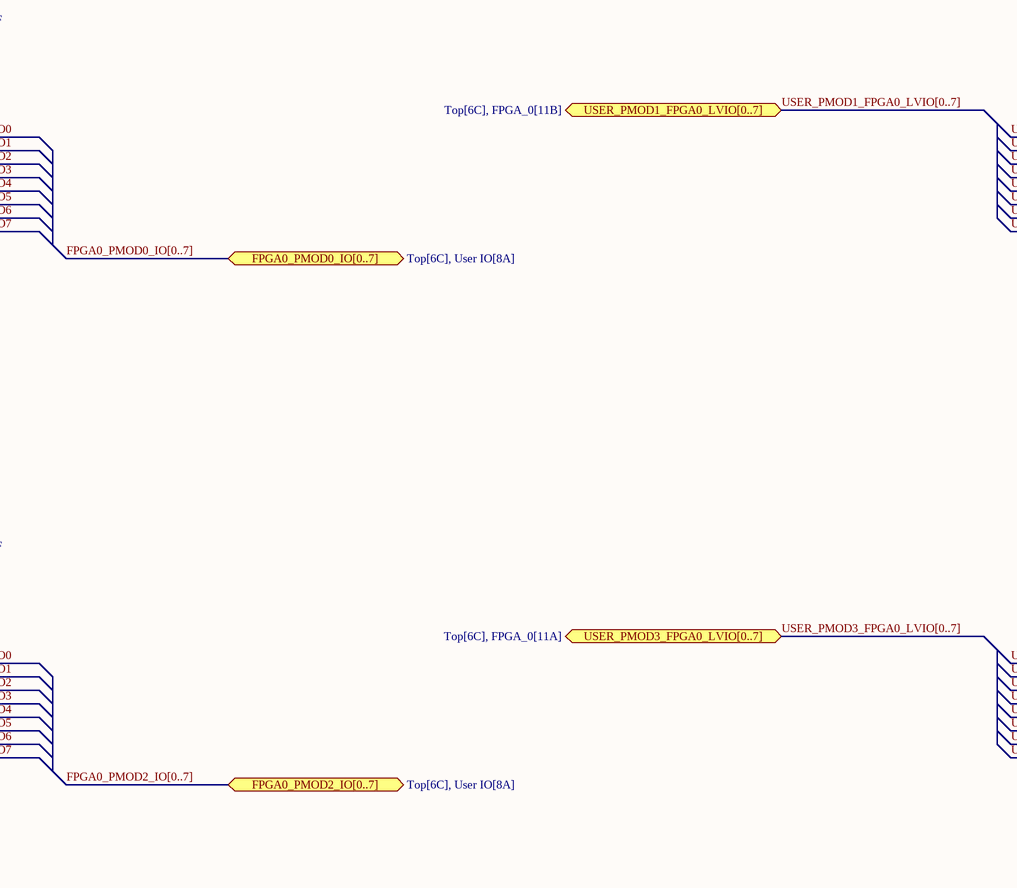
[diagram p32: User IO Buffers.SchDoc, bottom middle]
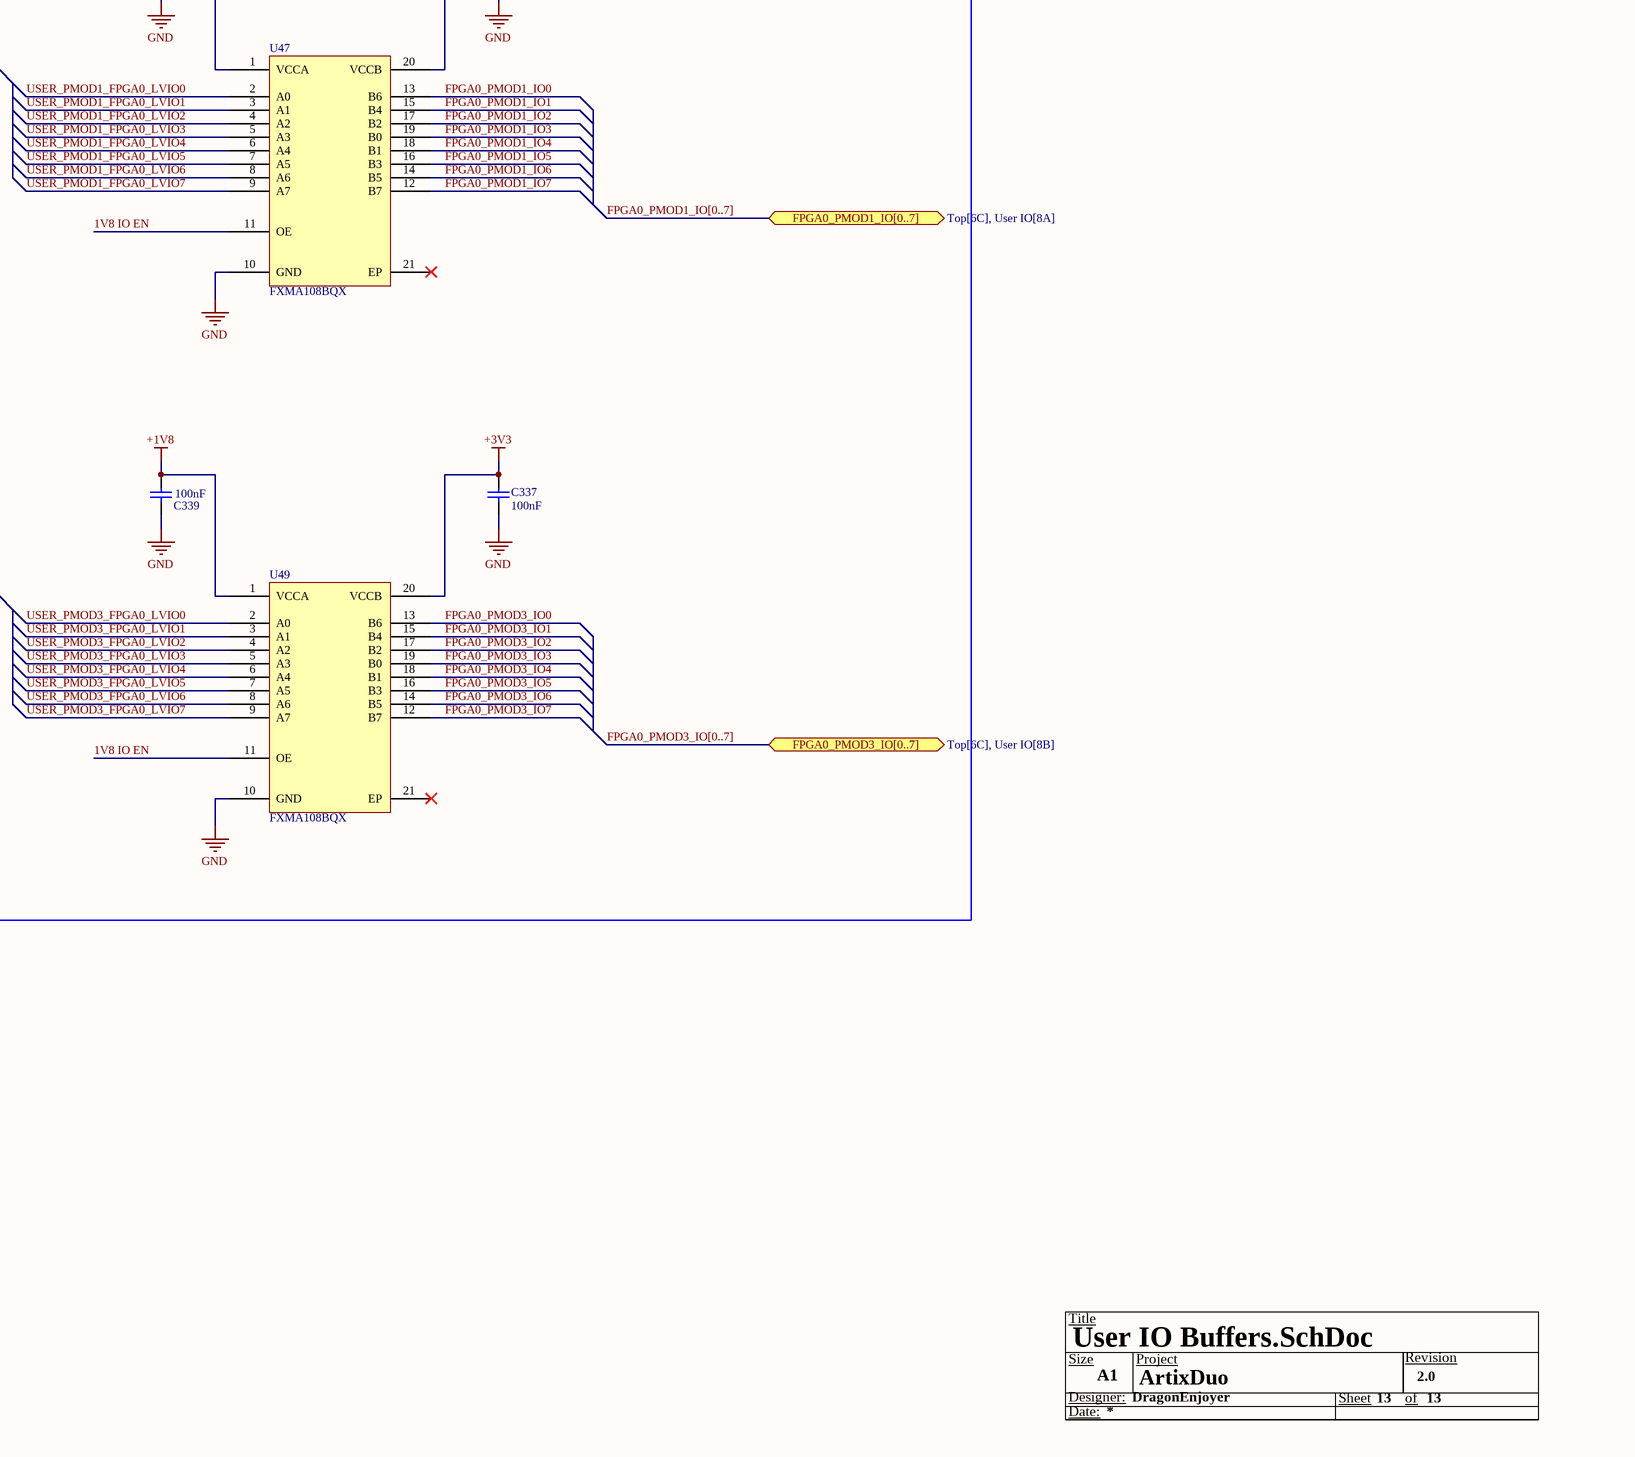
[diagram p33: User IO Buffers.SchDoc, bottom right]

### Parts
(Parts that share a designator on the sheet are numbered #1, #2 ... from top to bottom, then left to right.)
*#11  Size: A1  (hidden comment: Title Block)  (graphical)
C308  100nF  [CAPC1005X05N]
C309  100nF  [CAPC1005X05N]
C310  100nF  [CAPC1005X05N]
C311  100nF  [CAPC1005X05N]
C312  100nF  [CAPC1005X05N]
C313  100nF  [CAPC1005X05N]
C314  100nF  [CAPC1005X05N]
C315  100nF  [CAPC1005X05N]
C316  100nF  [CAPC1005X05N]
C317  100nF  [CAPC1005X05N]
C318  100nF  [CAPC1005X05N]
C319  100nF  [CAPC1005X05N]
C320  100nF  [CAPC1005X05N]
C321  100nF  [CAPC1005X05N]
C322  100nF  [CAPC1005X05N]
C323  100nF  [CAPC1005X05N]
C324  100nF  [CAPC1005X05N]
C325  100nF  [CAPC1005X05N]
C326  100nF  [CAPC1005X05N]
C327  100nF  [CAPC1005X05N]
C328  100nF  [CAPC1005X05N]
C329  100nF  [CAPC1005X05N]
C330  100nF  [CAPC1005X05N]
C331  100nF  [CAPC1005X05N]
C332  100nF  [CAPC1005X05N]
C333  100nF  [CAPC1005X05N]
C334  100nF  [CAPC1005X05N]
C335  100nF  [CAPC1005X05N]
C336  100nF  [CAPC1005X05N]
C337  100nF  [CAPC1005X05N]
C338  100nF  [CAPC1005X05N]
C339  100nF  [CAPC1005X05N]
C340  value 10uF  [CAPC1608X04N]  (hidden comment: GRM188R61E106MA73D)
C341  value 10uF  [CAPC1608X04N]  (hidden comment: GRM188R61E106MA73D)
Q21  2N7002-7-F  [FP-SOT23-MFG]
Q22  2N7002-7-F  [FP-SOT23-MFG]
R273  3.3K  [RESC1005X40X25NL05T10]
R274  3.3K  [RESC1005X40X25NL05T10]
R275  10K  [RESC1005X40X25NL05T10]
R276  10K  [RESC1005X40X25NL05T10]
R277  10K  [RESC1005X40X25NL05T10]
R278  10K  [RESC1005X40X25NL05T10]
U34  FXMA108BQX  [QFN50P450X250X80_HS-21N]
U35  FXMA108BQX  [QFN50P450X250X80_HS-21N]
U36  FXMA108BQX  [QFN50P450X250X80_HS-21N]
U37  FXMA108BQX  [QFN50P450X250X80_HS-21N]
U38  FXMA108BQX  [QFN50P450X250X80_HS-21N]
U39  FXMA108BQX  [QFN50P450X250X80_HS-21N]
U40  FXMA108BQX  [QFN50P450X250X80_HS-21N]
U41  FXMA108BQX  [QFN50P450X250X80_HS-21N]
U42  FXMA108BQX  [QFN50P450X250X80_HS-21N]
U43  FXMA108BQX  [QFN50P450X250X80_HS-21N]
U44  FXMA108BQX  [QFN50P450X250X80_HS-21N]
U45  FXMA108BQX  [QFN50P450X250X80_HS-21N]
U46  FXMA108BQX  [QFN50P450X250X80_HS-21N]
U47  FXMA108BQX  [QFN50P450X250X80_HS-21N]
U48  FXMA108BQX  [QFN50P450X250X80_HS-21N]
U49  FXMA108BQX  [QFN50P450X250X80_HS-21N]

### Blocks framed on the sheet
FPGA0 USER IO BUFFERS: C308-C319 U34-U39
FPGA1 USER IO BUFFERS: C320-C331 U40-U45
PMOD 1.8V TO 3V3 LVL SHIFTER: C332-C339 U46-U49

### Ports
FPGA0_PMOD0_IO[0..7] (bidir, see Top[6C], User IO[8A]), FPGA0_PMOD1_IO[0..7] (bidir, see Top[6C], User IO[8A]), FPGA0_PMOD2_IO[0..7] (bidir, see Top[6C], User IO[8A]), FPGA0_PMOD3_IO[0..7] (bidir, see Top[6C], User IO[8B]), USER_IO_FPGA0_IO[0..47] (bidir, see Top[6C], FPGA_0[8A]), USER_IO_FPGA1_IO[0..47] (bidir, see Top[4C], FPGA_1[8A]), USER_IOB0_BUFFER_IO[0..47] (bidir, see Top[6C], User IO[1A]), USER_IOB1_BUFFER_IO[0..47] (bidir, see Top[6C], User IO[1B]), USER_PMOD0_FPGA0_LVIO[0..7] (bidir, see Top[6C], FPGA_0[11B]), USER_PMOD1_FPGA0_LVIO[0..7] (bidir, see Top[6C], FPGA_0[11B]), USER_PMOD2_FPGA0_LVIO[0..7] (bidir, see Top[6C], FPGA_0[11A]), USER_PMOD3_FPGA0_LVIO[0..7] (bidir, see Top[6C], FPGA_0[11A])

### Nets
+1V8: C334.2 C335.2 C338.2 C339.2 R274.2 U46.1(VCCA) U47.1(VCCA) U48.1(VCCA) U49.1(VCCA)
+3V3: C308.2 C309.2 C310.2 C311.2 C312.2 C313.2 C314.2 C315.2 C316.2 C317.2 C318.2 C319.2 C320.2 C321.2 C322.2 C323.2 C324.2 C325.2 C326.2 C327.2 C328.2 C329.2 C330.2 C331.2 C332.2 C333.2 C336.2 C337.2 R273.2 U34.1(VCCA) U34.20(VCCB) U35.1(VCCA) U35.20(VCCB) U36.1(VCCA) U36.20(VCCB) U37.1(VCCA) U37.20(VCCB) U38.1(VCCA) U38.20(VCCB) U39.1(VCCA) U39.20(VCCB) U40.1(VCCA) U40.20(VCCB) U41.1(VCCA) U41.20(VCCB) U42.1(VCCA) U42.20(VCCB) U43.1(VCCA) U43.20(VCCB) U44.1(VCCA) U44.20(VCCB) U45.1(VCCA) U45.20(VCCB) U46.20(VCCB) U47.20(VCCB) U48.20(VCCB) U49.20(VCCB)
+5: R275.2 R276.2 R277.1 R278.1  [project net USB_5V0_AUX_IN]
GND: C308.1 C309.1 C310.1 C311.1 C312.1 C313.1 C314.1 C315.1 C316.1 C317.1 C318.1 C319.1 C320.1 C321.1 C322.1 C323.1 C324.1 C325.1 C326.1 C327.1 C328.1 C329.1 C330.1 C331.1 C332.1 C333.1 C334.1 C335.1 C336.1 C337.1 C338.1 C339.1 C340.1 C341.1 Q21.2(S) Q22.2(S) R277.2 R278.2 U34.10(GND) U35.10(GND) U36.10(GND) U37.10(GND) U38.10(GND) U39.10(GND) U40.10(GND) U41.10(GND) U42.10(GND) U43.10(GND) U44.10(GND) U45.10(GND) U46.10(GND) U47.10(GND) U48.10(GND) U49.10(GND)
1V8 IO EN: Q22.3(D) R274.1 U46.11(OE) U47.11(OE) U48.11(OE) U49.11(OE)
3V3 IO EN: Q21.3(D) R273.1 U34.11(OE) U35.11(OE) U36.11(OE) U37.11(OE) U38.11(OE) U39.11(OE) U40.11(OE) U41.11(OE) U42.11(OE) U43.11(OE) U44.11(OE) U45.11(OE)
FPGA0_PMOD0_IO0: U46.13(B6)
FPGA0_PMOD0_IO1: U46.15(B4)
FPGA0_PMOD0_IO2: U46.17(B2)
FPGA0_PMOD0_IO3: U46.19(B0)
FPGA0_PMOD0_IO4: U46.18(B1)
FPGA0_PMOD0_IO5: U46.16(B3)
FPGA0_PMOD0_IO6: U46.14(B5)
FPGA0_PMOD0_IO7: U46.12(B7)
FPGA0_PMOD1_IO0: U47.13(B6)
FPGA0_PMOD1_IO1: U47.15(B4)
FPGA0_PMOD1_IO2: U47.17(B2)
FPGA0_PMOD1_IO3: U47.19(B0)
FPGA0_PMOD1_IO4: U47.18(B1)
FPGA0_PMOD1_IO5: U47.16(B3)
FPGA0_PMOD1_IO6: U47.14(B5)
FPGA0_PMOD1_IO7: U47.12(B7)
FPGA0_PMOD2_IO0: U48.13(B6)
FPGA0_PMOD2_IO1: U48.15(B4)
FPGA0_PMOD2_IO2: U48.17(B2)
FPGA0_PMOD2_IO3: U48.19(B0)
FPGA0_PMOD2_IO4: U48.18(B1)
FPGA0_PMOD2_IO5: U48.16(B3)
FPGA0_PMOD2_IO6: U48.14(B5)
FPGA0_PMOD2_IO7: U48.12(B7)
FPGA0_PMOD3_IO0: U49.13(B6)
FPGA0_PMOD3_IO1: U49.15(B4)
FPGA0_PMOD3_IO2: U49.17(B2)
FPGA0_PMOD3_IO3: U49.19(B0)
FPGA0_PMOD3_IO4: U49.18(B1)
FPGA0_PMOD3_IO5: U49.16(B3)
FPGA0_PMOD3_IO6: U49.14(B5)
FPGA0_PMOD3_IO7: U49.12(B7)
USER_IO_FPGA0_IO0: U35.2(A0)
USER_IO_FPGA0_IO1: U35.3(A1)
USER_IO_FPGA0_IO2: U35.4(A2)
USER_IO_FPGA0_IO3: U35.5(A3)
USER_IO_FPGA0_IO4: U35.6(A4)
USER_IO_FPGA0_IO5: U35.7(A5)
USER_IO_FPGA0_IO6: U35.8(A6)
USER_IO_FPGA0_IO7: U35.9(A7)
USER_IO_FPGA0_IO8: U37.2(A0)
USER_IO_FPGA0_IO9: U37.3(A1)
USER_IO_FPGA0_IO10: U37.4(A2)
USER_IO_FPGA0_IO11: U37.5(A3)
USER_IO_FPGA0_IO12: U37.6(A4)
USER_IO_FPGA0_IO13: U37.7(A5)
USER_IO_FPGA0_IO14: U37.8(A6)
USER_IO_FPGA0_IO15: U37.9(A7)
USER_IO_FPGA0_IO16: U36.2(A0)
USER_IO_FPGA0_IO17: U36.3(A1)
USER_IO_FPGA0_IO18: U36.4(A2)
USER_IO_FPGA0_IO19: U36.5(A3)
USER_IO_FPGA0_IO20: U36.6(A4)
USER_IO_FPGA0_IO21: U36.7(A5)
USER_IO_FPGA0_IO22: U36.8(A6)
USER_IO_FPGA0_IO23: U36.9(A7)
USER_IO_FPGA0_IO24: U34.2(A0)
USER_IO_FPGA0_IO25: U34.3(A1)
USER_IO_FPGA0_IO26: U34.4(A2)
USER_IO_FPGA0_IO27: U34.5(A3)
USER_IO_FPGA0_IO28: U34.6(A4)
USER_IO_FPGA0_IO29: U34.7(A5)
USER_IO_FPGA0_IO30: U34.8(A6)
USER_IO_FPGA0_IO31: U34.9(A7)
USER_IO_FPGA0_IO32: U38.2(A0)
USER_IO_FPGA0_IO33: U38.3(A1)
USER_IO_FPGA0_IO34: U38.4(A2)
USER_IO_FPGA0_IO35: U38.5(A3)
USER_IO_FPGA0_IO36: U38.6(A4)
USER_IO_FPGA0_IO37: U38.7(A5)
USER_IO_FPGA0_IO38: U38.8(A6)
USER_IO_FPGA0_IO39: U38.9(A7)
USER_IO_FPGA0_IO40: U39.2(A0)
USER_IO_FPGA0_IO41: U39.3(A1)
USER_IO_FPGA0_IO42: U39.4(A2)
USER_IO_FPGA0_IO43: U39.5(A3)
USER_IO_FPGA0_IO44: U39.6(A4)
USER_IO_FPGA0_IO45: U39.7(A5)
USER_IO_FPGA0_IO46: U39.8(A6)
USER_IO_FPGA0_IO47: U39.9(A7)
USER_IO_FPGA1_IO0: U40.2(A0)
USER_IO_FPGA1_IO1: U40.3(A1)
USER_IO_FPGA1_IO2: U40.4(A2)
USER_IO_FPGA1_IO3: U40.5(A3)
USER_IO_FPGA1_IO4: U40.6(A4)
USER_IO_FPGA1_IO5: U40.7(A5)
USER_IO_FPGA1_IO6: U40.8(A6)
USER_IO_FPGA1_IO7: U40.9(A7)
USER_IO_FPGA1_IO8: U41.2(A0)
USER_IO_FPGA1_IO9: U41.3(A1)
USER_IO_FPGA1_IO10: U41.4(A2)
USER_IO_FPGA1_IO11: U41.5(A3)
USER_IO_FPGA1_IO12: U41.6(A4)
USER_IO_FPGA1_IO13: U41.7(A5)
USER_IO_FPGA1_IO14: U41.8(A6)
USER_IO_FPGA1_IO15: U41.9(A7)
USER_IO_FPGA1_IO16: U42.2(A0)
USER_IO_FPGA1_IO17: U42.3(A1)
USER_IO_FPGA1_IO18: U42.4(A2)
USER_IO_FPGA1_IO19: U42.5(A3)
USER_IO_FPGA1_IO20: U42.6(A4)
USER_IO_FPGA1_IO21: U42.7(A5)
USER_IO_FPGA1_IO22: U42.8(A6)
USER_IO_FPGA1_IO23: U42.9(A7)
USER_IO_FPGA1_IO24: U44.2(A0)
USER_IO_FPGA1_IO25: U44.3(A1)
USER_IO_FPGA1_IO26: U44.4(A2)
USER_IO_FPGA1_IO27: U44.5(A3)
USER_IO_FPGA1_IO28: U44.6(A4)
USER_IO_FPGA1_IO29: U44.7(A5)
USER_IO_FPGA1_IO30: U44.8(A6)
USER_IO_FPGA1_IO31: U44.9(A7)
USER_IO_FPGA1_IO32: U43.2(A0)
USER_IO_FPGA1_IO33: U43.3(A1)
USER_IO_FPGA1_IO34: U43.4(A2)
USER_IO_FPGA1_IO35: U43.5(A3)
USER_IO_FPGA1_IO36: U43.6(A4)
USER_IO_FPGA1_IO37: U43.7(A5)
USER_IO_FPGA1_IO38: U43.8(A6)
USER_IO_FPGA1_IO39: U43.9(A7)
USER_IO_FPGA1_IO40: U45.2(A0)
USER_IO_FPGA1_IO41: U45.3(A1)
USER_IO_FPGA1_IO42: U45.4(A2)
USER_IO_FPGA1_IO43: U45.5(A3)
USER_IO_FPGA1_IO44: U45.6(A4)
USER_IO_FPGA1_IO45: U45.7(A5)
USER_IO_FPGA1_IO46: U45.8(A6)
USER_IO_FPGA1_IO47: U45.9(A7)
USER_IOB0_BUFFER_IO0: U35.19(B0)
USER_IOB0_BUFFER_IO1: U35.18(B1)
USER_IOB0_BUFFER_IO2: U35.17(B2)
USER_IOB0_BUFFER_IO3: U35.16(B3)
USER_IOB0_BUFFER_IO4: U35.15(B4)
USER_IOB0_BUFFER_IO5: U35.14(B5)
USER_IOB0_BUFFER_IO6: U35.13(B6)
USER_IOB0_BUFFER_IO7: U35.12(B7)
USER_IOB0_BUFFER_IO8: U37.19(B0)
USER_IOB0_BUFFER_IO9: U37.18(B1)
USER_IOB0_BUFFER_IO10: U37.17(B2)
USER_IOB0_BUFFER_IO11: U37.16(B3)
USER_IOB0_BUFFER_IO12: U37.15(B4)
USER_IOB0_BUFFER_IO13: U37.14(B5)
USER_IOB0_BUFFER_IO14: U37.13(B6)
USER_IOB0_BUFFER_IO15: U37.12(B7)
USER_IOB0_BUFFER_IO16: U36.19(B0)
USER_IOB0_BUFFER_IO17: U36.18(B1)
USER_IOB0_BUFFER_IO18: U36.17(B2)
USER_IOB0_BUFFER_IO19: U36.16(B3)
USER_IOB0_BUFFER_IO20: U36.15(B4)
USER_IOB0_BUFFER_IO21: U36.14(B5)
USER_IOB0_BUFFER_IO22: U36.13(B6)
USER_IOB0_BUFFER_IO23: U36.12(B7)
USER_IOB0_BUFFER_IO24: U34.19(B0)
USER_IOB0_BUFFER_IO25: U34.18(B1)
USER_IOB0_BUFFER_IO26: U34.17(B2)
USER_IOB0_BUFFER_IO27: U34.16(B3)
USER_IOB0_BUFFER_IO28: U34.15(B4)
USER_IOB0_BUFFER_IO29: U34.14(B5)
USER_IOB0_BUFFER_IO30: U34.13(B6)
USER_IOB0_BUFFER_IO31: U34.12(B7)
USER_IOB0_BUFFER_IO32: U38.19(B0)
USER_IOB0_BUFFER_IO33: U38.18(B1)
USER_IOB0_BUFFER_IO34: U38.17(B2)
USER_IOB0_BUFFER_IO35: U38.16(B3)
USER_IOB0_BUFFER_IO36: U38.15(B4)
USER_IOB0_BUFFER_IO37: U38.14(B5)
USER_IOB0_BUFFER_IO38: U38.13(B6)
USER_IOB0_BUFFER_IO39: U38.12(B7)
USER_IOB0_BUFFER_IO40: U39.19(B0)
USER_IOB0_BUFFER_IO41: U39.18(B1)
USER_IOB0_BUFFER_IO42: U39.17(B2)
USER_IOB0_BUFFER_IO43: U39.16(B3)
USER_IOB0_BUFFER_IO44: U39.15(B4)
USER_IOB0_BUFFER_IO45: U39.14(B5)
USER_IOB0_BUFFER_IO46: U39.13(B6)
USER_IOB0_BUFFER_IO47: U39.12(B7)
USER_IOB1_BUFFER_IO0: U40.19(B0)
USER_IOB1_BUFFER_IO1: U40.18(B1)
USER_IOB1_BUFFER_IO2: U40.17(B2)
USER_IOB1_BUFFER_IO3: U40.16(B3)
USER_IOB1_BUFFER_IO4: U40.15(B4)
USER_IOB1_BUFFER_IO5: U40.14(B5)
USER_IOB1_BUFFER_IO6: U40.13(B6)
USER_IOB1_BUFFER_IO7: U40.12(B7)
USER_IOB1_BUFFER_IO8: U41.19(B0)
USER_IOB1_BUFFER_IO9: U41.18(B1)
USER_IOB1_BUFFER_IO10: U41.17(B2)
USER_IOB1_BUFFER_IO11: U41.16(B3)
USER_IOB1_BUFFER_IO12: U41.15(B4)
USER_IOB1_BUFFER_IO13: U41.14(B5)
USER_IOB1_BUFFER_IO14: U41.13(B6)
USER_IOB1_BUFFER_IO15: U41.12(B7)
USER_IOB1_BUFFER_IO16: U42.19(B0)
USER_IOB1_BUFFER_IO17: U42.18(B1)
USER_IOB1_BUFFER_IO18: U42.17(B2)
USER_IOB1_BUFFER_IO19: U42.16(B3)
USER_IOB1_BUFFER_IO20: U42.15(B4)
USER_IOB1_BUFFER_IO21: U42.14(B5)
USER_IOB1_BUFFER_IO22: U42.13(B6)
USER_IOB1_BUFFER_IO23: U42.12(B7)
USER_IOB1_BUFFER_IO24: U44.19(B0)
USER_IOB1_BUFFER_IO25: U44.18(B1)
USER_IOB1_BUFFER_IO26: U44.17(B2)
USER_IOB1_BUFFER_IO27: U44.16(B3)
USER_IOB1_BUFFER_IO28: U44.15(B4)
USER_IOB1_BUFFER_IO29: U44.14(B5)
USER_IOB1_BUFFER_IO30: U44.13(B6)
USER_IOB1_BUFFER_IO31: U44.12(B7)
USER_IOB1_BUFFER_IO32: U43.19(B0)
USER_IOB1_BUFFER_IO33: U43.18(B1)
USER_IOB1_BUFFER_IO34: U43.17(B2)
USER_IOB1_BUFFER_IO35: U43.16(B3)
USER_IOB1_BUFFER_IO36: U43.15(B4)
USER_IOB1_BUFFER_IO37: U43.14(B5)
USER_IOB1_BUFFER_IO38: U43.13(B6)
USER_IOB1_BUFFER_IO39: U43.12(B7)
USER_IOB1_BUFFER_IO40: U45.19(B0)
USER_IOB1_BUFFER_IO41: U45.18(B1)
USER_IOB1_BUFFER_IO42: U45.17(B2)
USER_IOB1_BUFFER_IO43: U45.16(B3)
USER_IOB1_BUFFER_IO44: U45.15(B4)
USER_IOB1_BUFFER_IO45: U45.14(B5)
USER_IOB1_BUFFER_IO46: U45.13(B6)
USER_IOB1_BUFFER_IO47: U45.12(B7)
USER_PMOD0_FPGA0_LVIO0: U46.2(A0)
USER_PMOD0_FPGA0_LVIO1: U46.3(A1)
USER_PMOD0_FPGA0_LVIO2: U46.4(A2)
USER_PMOD0_FPGA0_LVIO3: U46.5(A3)
USER_PMOD0_FPGA0_LVIO4: U46.6(A4)
USER_PMOD0_FPGA0_LVIO5: U46.7(A5)
USER_PMOD0_FPGA0_LVIO6: U46.8(A6)
USER_PMOD0_FPGA0_LVIO7: U46.9(A7)
USER_PMOD1_FPGA0_LVIO0: U47.2(A0)
USER_PMOD1_FPGA0_LVIO1: U47.3(A1)
USER_PMOD1_FPGA0_LVIO2: U47.4(A2)
USER_PMOD1_FPGA0_LVIO3: U47.5(A3)
USER_PMOD1_FPGA0_LVIO4: U47.6(A4)
USER_PMOD1_FPGA0_LVIO5: U47.7(A5)
USER_PMOD1_FPGA0_LVIO6: U47.8(A6)
USER_PMOD1_FPGA0_LVIO7: U47.9(A7)
USER_PMOD2_FPGA0_LVIO0: U48.2(A0)
USER_PMOD2_FPGA0_LVIO1: U48.3(A1)
USER_PMOD2_FPGA0_LVIO2: U48.4(A2)
USER_PMOD2_FPGA0_LVIO3: U48.5(A3)
USER_PMOD2_FPGA0_LVIO4: U48.6(A4)
USER_PMOD2_FPGA0_LVIO5: U48.7(A5)
USER_PMOD2_FPGA0_LVIO6: U48.8(A6)
USER_PMOD2_FPGA0_LVIO7: U48.9(A7)
USER_PMOD3_FPGA0_LVIO0: U49.2(A0)
USER_PMOD3_FPGA0_LVIO1: U49.3(A1)
USER_PMOD3_FPGA0_LVIO2: U49.4(A2)
USER_PMOD3_FPGA0_LVIO3: U49.5(A3)
USER_PMOD3_FPGA0_LVIO4: U49.6(A4)
USER_PMOD3_FPGA0_LVIO5: U49.7(A5)
USER_PMOD3_FPGA0_LVIO6: U49.8(A6)
USER_PMOD3_FPGA0_LVIO7: U49.9(A7)
NetC340_2: C340.2 Q21.1(G) R275.1
NetC341_2: C341.2 Q22.1(G) R276.1

Not connected (* = marked no-connect by the designer): U34 21(EP)*; U35 21(EP)*; U36 21(EP)*; U37 21(EP)*; U38 21(EP)*; U39 21(EP)*; U40 21(EP)*; U41 21(EP)*; U42 21(EP)*; U43 21(EP)*; U44 21(EP)*; U45 21(EP)*; U46 21(EP)*; U47 21(EP)*; U48 21(EP)*; U49 21(EP)*

### Buses and harness runs
bus FPGA0_PMOD0_IO[0..7] = port FPGA0_PMOD0_IO[0..7]
bus FPGA0_PMOD1_IO[0..7] = port FPGA0_PMOD1_IO[0..7]
bus FPGA0_PMOD2_IO[0..7] = port FPGA0_PMOD2_IO[0..7]
bus FPGA0_PMOD3_IO[0..7] = port FPGA0_PMOD3_IO[0..7]
bus USER_IO_FPGA0_IO[0..47] = port USER_IO_FPGA0_IO[0..47]
bus USER_IO_FPGA1_IO[0..47] = port USER_IO_FPGA1_IO[0..47]
bus USER_IOB0_BUFFER_IO[0..47] = port USER_IOB0_BUFFER_IO[0..47]
bus USER_IOB1_BUFFER_IO[0..47] = port USER_IOB1_BUFFER_IO[0..47]
bus USER_PMOD0_FPGA0_LVIO[0..7] = port USER_PMOD0_FPGA0_LVIO[0..7]
bus USER_PMOD1_FPGA0_LVIO[0..7] = port USER_PMOD1_FPGA0_LVIO[0..7]
bus USER_PMOD2_FPGA0_LVIO[0..7] = port USER_PMOD2_FPGA0_LVIO[0..7]
bus USER_PMOD3_FPGA0_LVIO[0..7] = port USER_PMOD3_FPGA0_LVIO[0..7]

### Notes on the sheet
- TIME DELAY FOR IO BUFFERS
- (in symbol CMP-007-000006-8) Title; Size; Project; Revision; Designer:; Sheet; of; Date:

### Library data of the parts
*#11 = CMP-007-000006-8: Generic Title Block
C308-C339 = CMP-001-00095-1: as C288-C307 on sheet High Speed User IO; Voltage: 50V; Capacitance: 100nF; Case: 0402
C340 C341 = CMP-001-00096-1: CAP CER 10UF 25V X5R 0603; Tolerance: 20%; Dielectric: X5R; Case/Package: 0603; Voltage: 25V
Q21 Q22 = CMP-2000-04929-2: MOSFET N-CH 60V 115MA SOT23-3; Turn-On Delay Time: 7ns; Turn-Off Delay Time: 11ns; Drain to Source Resistance: 7.5R; Rise Time: 3ns; Drain to Source Breakdown Voltage: 70V; Input Capacitance: 50pF; Number of Elements: 1; Power Dissipation: 540mW; Max Power Dissipation: 300mW; Fall Time: 5.6ns; Gate to Source Voltage (Vgs): 20V; Threshold Voltage: 2.5V; Element Configuration: Single; Termination: SMD/SMT; Weight: 0.000282oz; Radiation Hardening: No; Max Operating Temperature: 150°C; On-State Resistance: 7.5R; Mount: Surface Mount; Current Rating: 115mA; Contact Plating: Tin; Lead Free: Lead Free; Min Operating Temperature: -55°C; Number of Pins: 3; REACH SVHC: No SVHC; Drain to Source Voltage (Vdss): 60V; Width: 1.3mm; Package Quantity: 3000; Length: 2.9mm; Case/Package: SOT-23; Number of Channels: 1; Dual Supply Voltage: 60V; Packaging: Tape and Reel; Height: 1mm; Voltage Rating (DC): 60V; Nominal Vgs: 2.5V; Continuous Drain Current (ID): 115mA; Voltage: 60V; Rds On Max: 7.5R
R273 R274 = CMP-2002-03055-1: CRCW04023K30FKEDHP; Manufacturer: Vishay Dale; Part Number: CRCW04023K30FKEDHP
R275-R278 = CMP-2002-07353-1: RC0402FR-0710KL; Manufacturer: Yageo / Phycomp; Part Number: RC0402FR-0710KL
U34-U49 = CMP-015-00018-1: FXMA108 Series 3.6 V Surface Mount Dual Supply 8-Bit Voltage Translator -DQFN-20; Min Supply Voltage: 1.65V; Propagation Delay: 1700ns; Number of Circuits: 1; Number of Channels: 8; Max Supply Voltage: 5.5V; Data Rate: 100Mbps; Logic Function: Translator; Case/Package: QFN

## Sheet HYPERRAM.SchDoc
size A4; SheetNumber: 11; SheetTotal: 13
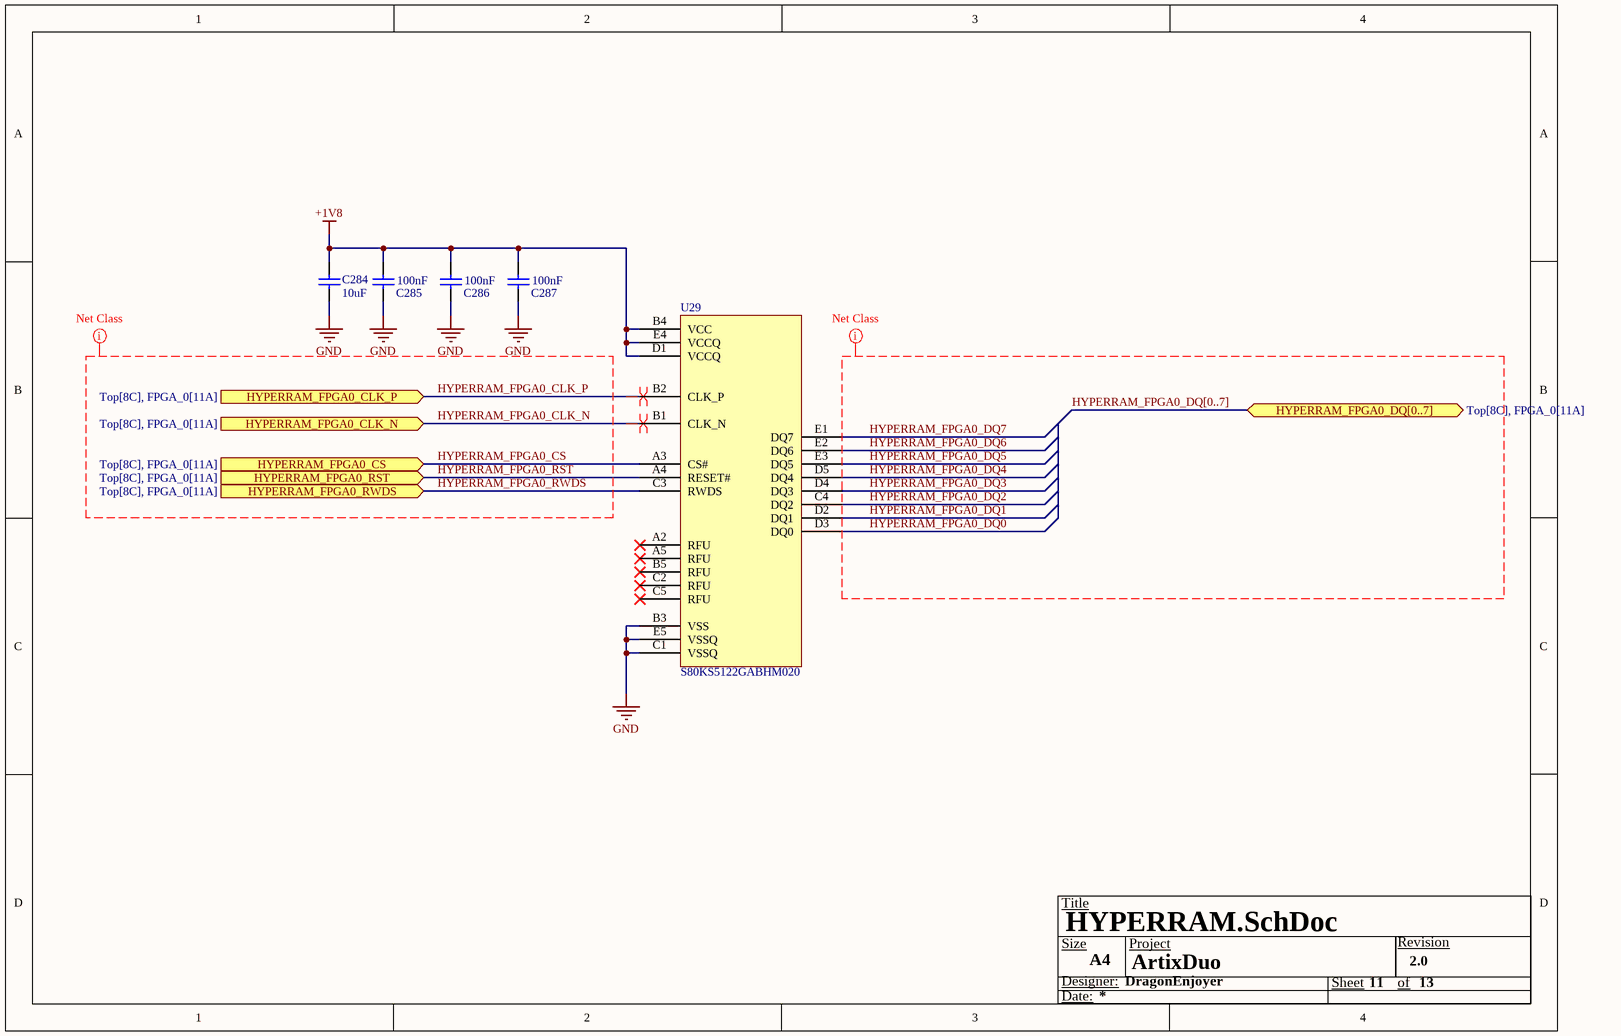
[diagram p34: HYPERRAM.SchDoc]

### Parts
(Parts that share a designator on the sheet are numbered #1, #2 ... from top to bottom, then left to right.)
*#12  Size: A4  (hidden comment: Title Block)  (graphical)
C284  10uF  [CAPC1005X70X10NL05]
C285  100nF  [CAPC1005X05N]
C286  100nF  [CAPC1005X05N]
C287  100nF  [CAPC1005X05N]
U29  S80KS5122GABHM020  [BGA25C100P5X5_800X600X100]

### Ports
HYPERRAM_FPGA0_CLK_N (in, see Top[8C], FPGA_0[11A]), HYPERRAM_FPGA0_CLK_P (in, see Top[8C], FPGA_0[11A]), HYPERRAM_FPGA0_CS (in, see Top[8C], FPGA_0[11A]), HYPERRAM_FPGA0_DQ[0..7] (bidir, see Top[8C], FPGA_0[11A]), HYPERRAM_FPGA0_RST (in, see Top[8C], FPGA_0[11A]), HYPERRAM_FPGA0_RWDS (in, see Top[8C], FPGA_0[11A])

### Nets
+1V8: C284.2 C285.2 C286.2 C287.2 U29.B4(VCC) U29.D1(VCCQ) U29.E4(VCCQ)
GND: C284.1 C285.1 C286.1 C287.1 U29.B3(VSS) U29.C1(VSSQ) U29.E5(VSSQ)
HYPERRAM_FPGA0_CLK_N: U29.B1(CLK_N) ; port HYPERRAM_FPGA0_CLK_N
HYPERRAM_FPGA0_CLK_P: U29.B2(CLK_P) ; port HYPERRAM_FPGA0_CLK_P
HYPERRAM_FPGA0_CS: U29.A3(CS#) ; port HYPERRAM_FPGA0_CS
HYPERRAM_FPGA0_DQ0: U29.D3(DQ0)
HYPERRAM_FPGA0_DQ1: U29.D2(DQ1)
HYPERRAM_FPGA0_DQ2: U29.C4(DQ2)
HYPERRAM_FPGA0_DQ3: U29.D4(DQ3)
HYPERRAM_FPGA0_DQ4: U29.D5(DQ4)
HYPERRAM_FPGA0_DQ5: U29.E3(DQ5)
HYPERRAM_FPGA0_DQ6: U29.E2(DQ6)
HYPERRAM_FPGA0_DQ7: U29.E1(DQ7)
HYPERRAM_FPGA0_RST: U29.A4(RESET#) ; port HYPERRAM_FPGA0_RST
HYPERRAM_FPGA0_RWDS: U29.C3(RWDS) ; port HYPERRAM_FPGA0_RWDS

Not connected (* = marked no-connect by the designer): U29 A2(RFU)* A5(RFU)* B5(RFU)* C2(RFU)* C5(RFU)*

### Buses and harness runs
bus HYPERRAM_FPGA0_DQ[0..7] = port HYPERRAM_FPGA0_DQ[0..7]

### Layout directives
net class PSRAM CMC: HYPERRAM_FPGA0_CLK_N, HYPERRAM_FPGA0_CLK_P, HYPERRAM_FPGA0_CS, HYPERRAM_FPGA0_RST, HYPERRAM_FPGA0_RWDS
net class PSRAM DATA: HYPERRAM_FPGA0_DQ0, HYPERRAM_FPGA0_DQ1, HYPERRAM_FPGA0_DQ2, HYPERRAM_FPGA0_DQ3, HYPERRAM_FPGA0_DQ4, HYPERRAM_FPGA0_DQ5, HYPERRAM_FPGA0_DQ6, HYPERRAM_FPGA0_DQ7, HYPERRAM_FPGA0_DQ[0..7]
differential pair: HYPERRAM_FPGA0_CLK_N, HYPERRAM_FPGA0_CLK_P

### Notes on the sheet
- (in symbol CMP-007-000006-8) Title; Size; Project; Revision; Designer:; Sheet; of; Date:

### Library data of the parts
*#12 = CMP-007-000006-8: Generic Title Block
C284 = CMP-2000-05993-1: Chip Capacitor, 10 uF, +/- 20%, -55 to 85 degC, 0402 (1005 Metric), RoHS, Tape and Reel C1005X5R0J106M050BC; PCN Part Number: MLCCPartNumberChange30/Nov/2012; Manufacturer: TDK; Voltage - Rated: 6.3V; Capacitance: 10µF; Product Training Modules: CSeriesGeneralApplicationsSEAT,CCV,andTVCLDesignToolsGuidetoReplacinganElectrolyticCapacitorwithanMLCC; Online Catalog: CSeries,GeneralPurpose; Kits: 445-9021-KIT-ND-KITMLCC100PF-10UF04026.3-50V445-9003-KIT-ND-KITCAPCERHICAPMLCCSMD; Temperature Coefficient: X5R; Other Names: 445-8920-1; Standard Package: 1; Datasheet URL: http://download.siliconexpert.com/pdfs/2015/4/21/15/54/45/779/tdk_/manual/37024850441143360mlcc_commercial_general_en.pdf; Package Description: 2-Pin Surface Mount Device, Body 1.00 x 0.50 mm; Lead Style: -; RoHS Information: RoHSCertificate-MLCC; Mounting Technology: SurfaceMount; Manufacturer URL: http://www.tdk.com/; Packaging: CutTape(CT); Series: C; Category: Capacitors; Operating Temperature: -55°C~85°C; Ratings: -; Applications: GeneralPurpose; Lead Spacing: -; Family: CeramicCapacitors; Mounting Type: SurfaceMount,MLCC; Package / Case: 0402(1005Metric); Features: -; Thickness (Max): 0.020"(0.50mm); Size / Dimension: 0.039"Lx0.020"W(1.00mmx0.50mm); Datasheet Version: 03/2015; Package Reference: 0402; Tolerance: ±20%; Height - Seated (Max): -
C285-C287 = CMP-001-00095-1: as C288-C307 on sheet High Speed User IO; Voltage: 50V; Capacitance: 100nF; Case: 0402
U29 = CMP-019-00066-3: 512M-bit 200Mhz HYPERRAM

## Sheet Architecture.SchDoc
size A3; SheetNumber: 2; SheetTotal: 14
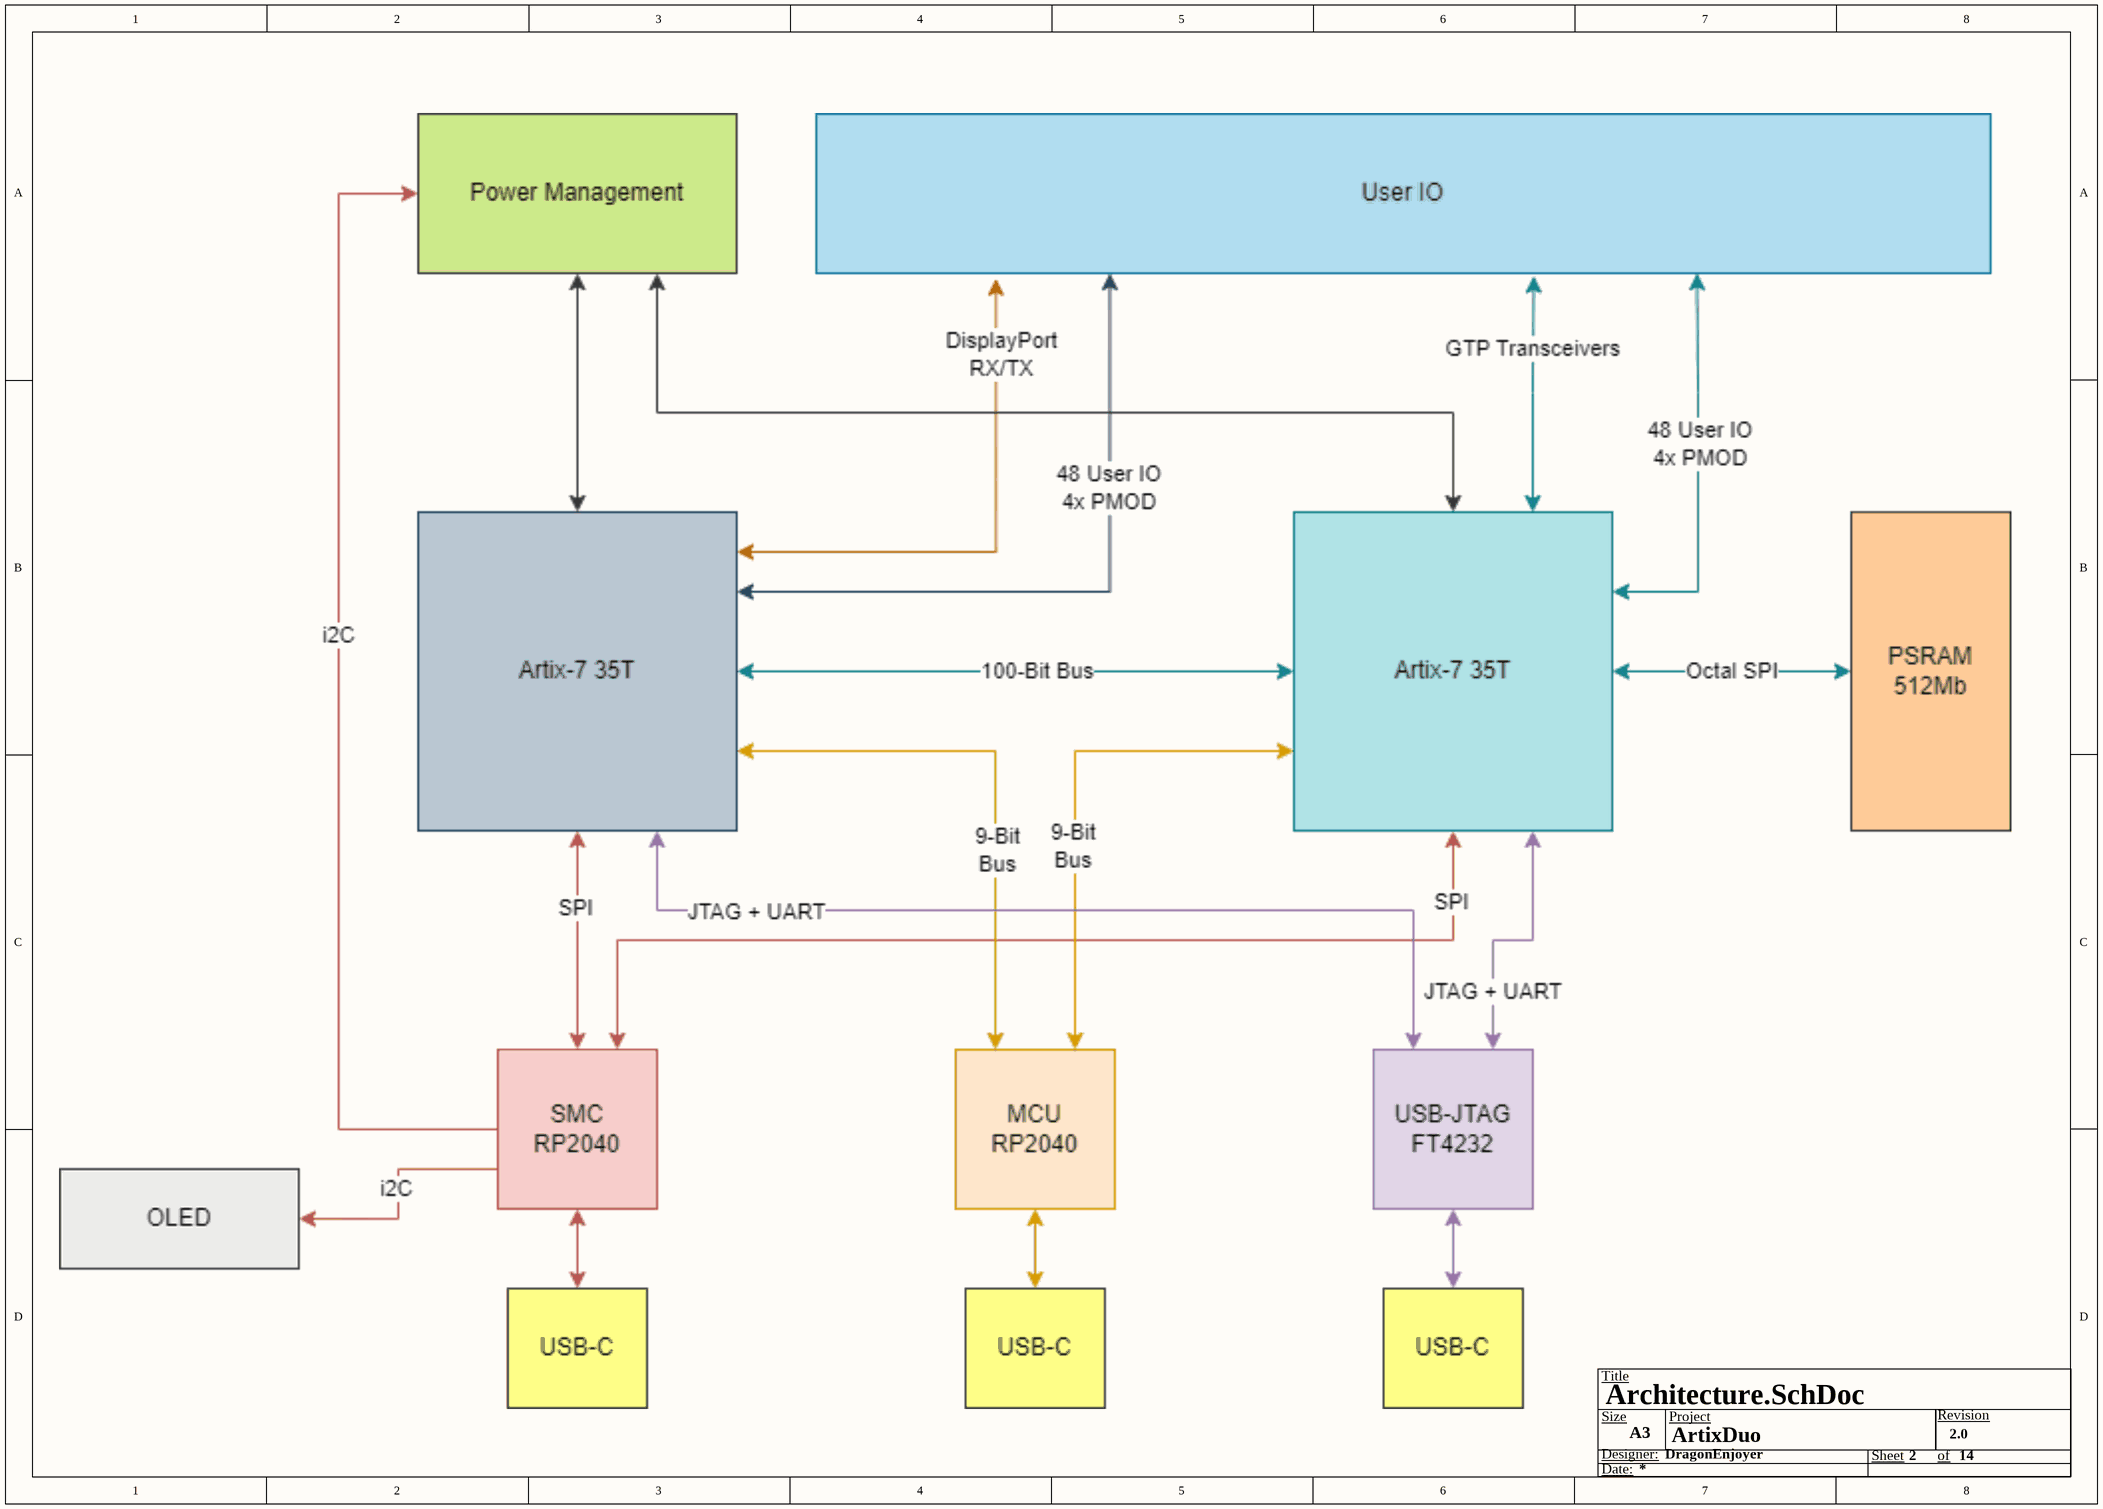
[diagram p35: Architecture.SchDoc]

### Parts
(Parts that share a designator on the sheet are numbered #1, #2 ... from top to bottom, then left to right.)
*#13  Size: A3  (hidden comment: Title Block)  (graphical)

### Notes on the sheet
- (in symbol CMP-007-000006-8) Title; Size; Project; Revision; Designer:; Sheet; of; Date:

### Library data of the parts
*#13 = CMP-007-000006-8: Generic Title Block

## Sheet FPGA1 PMOD Buffers.SchDoc
size A2; SheetNumber: 14; SheetTotal: 14
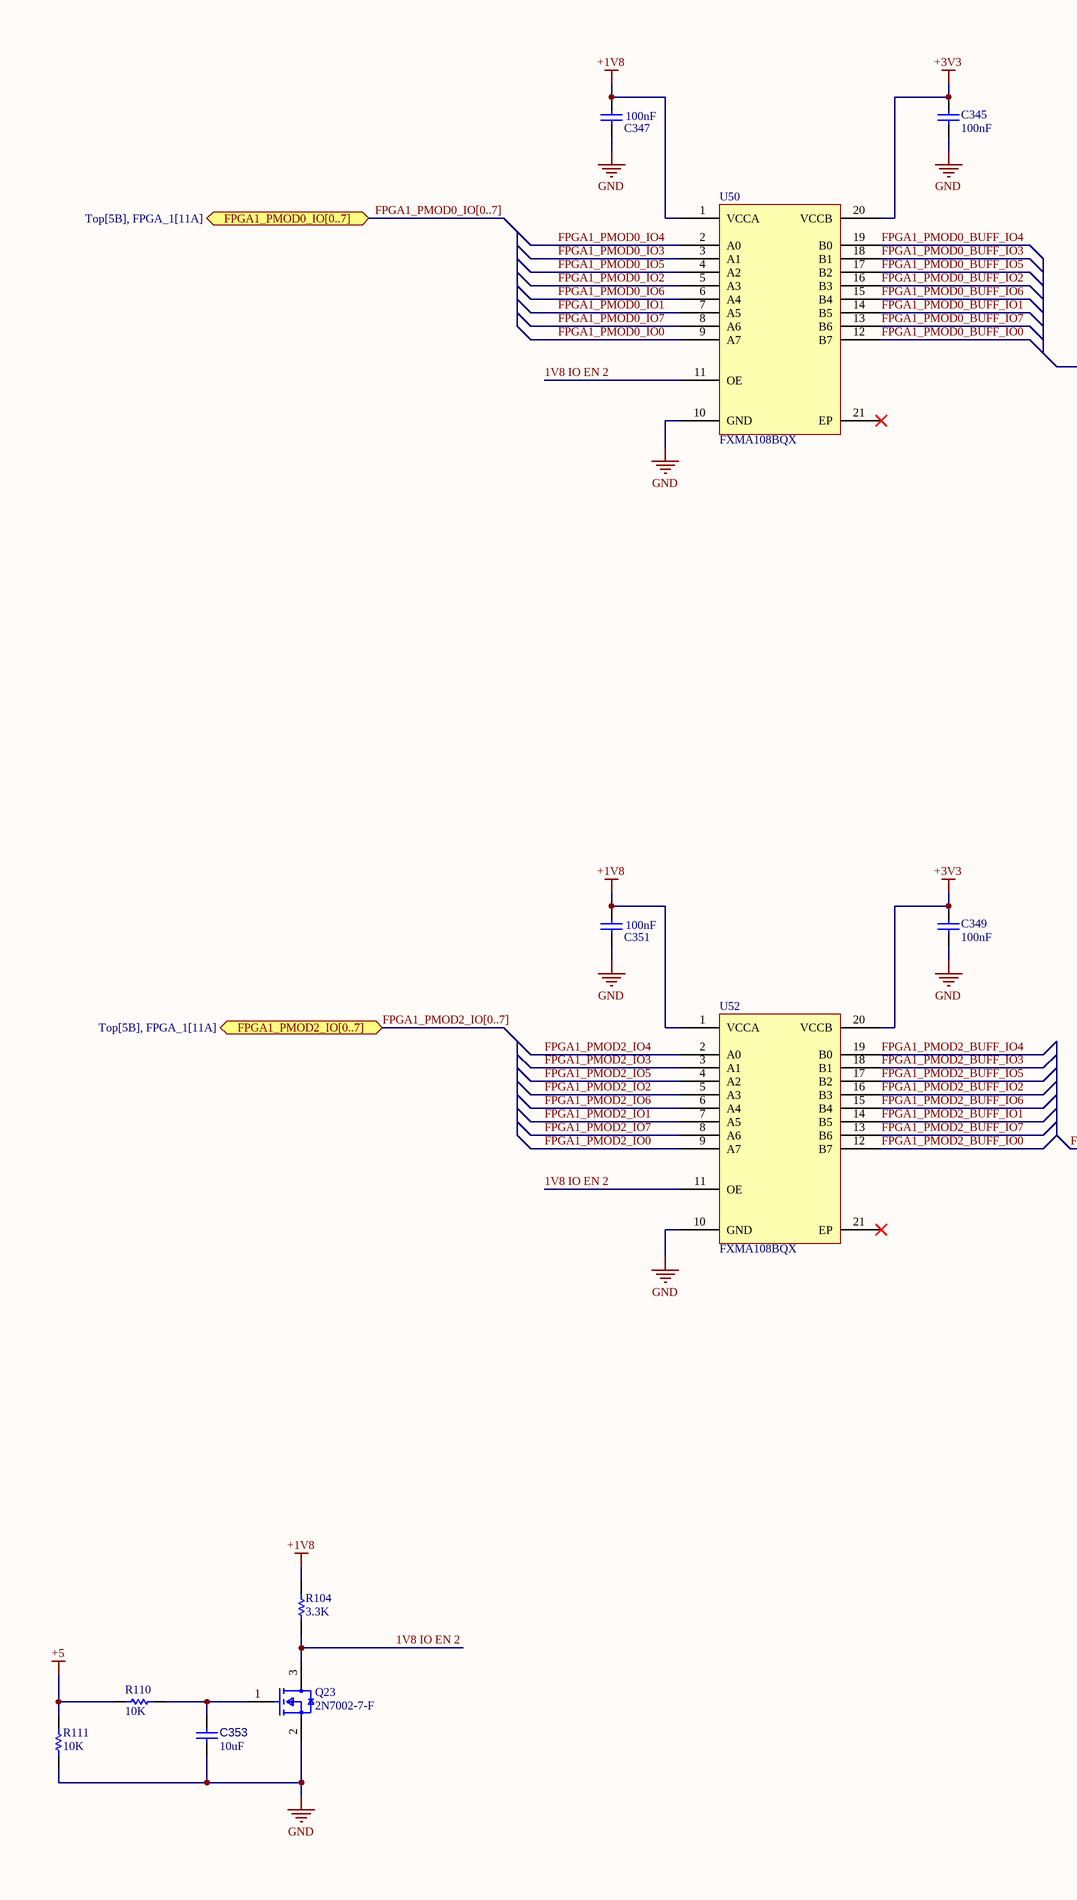
[diagram p36: FPGA1 PMOD Buffers.SchDoc, left]
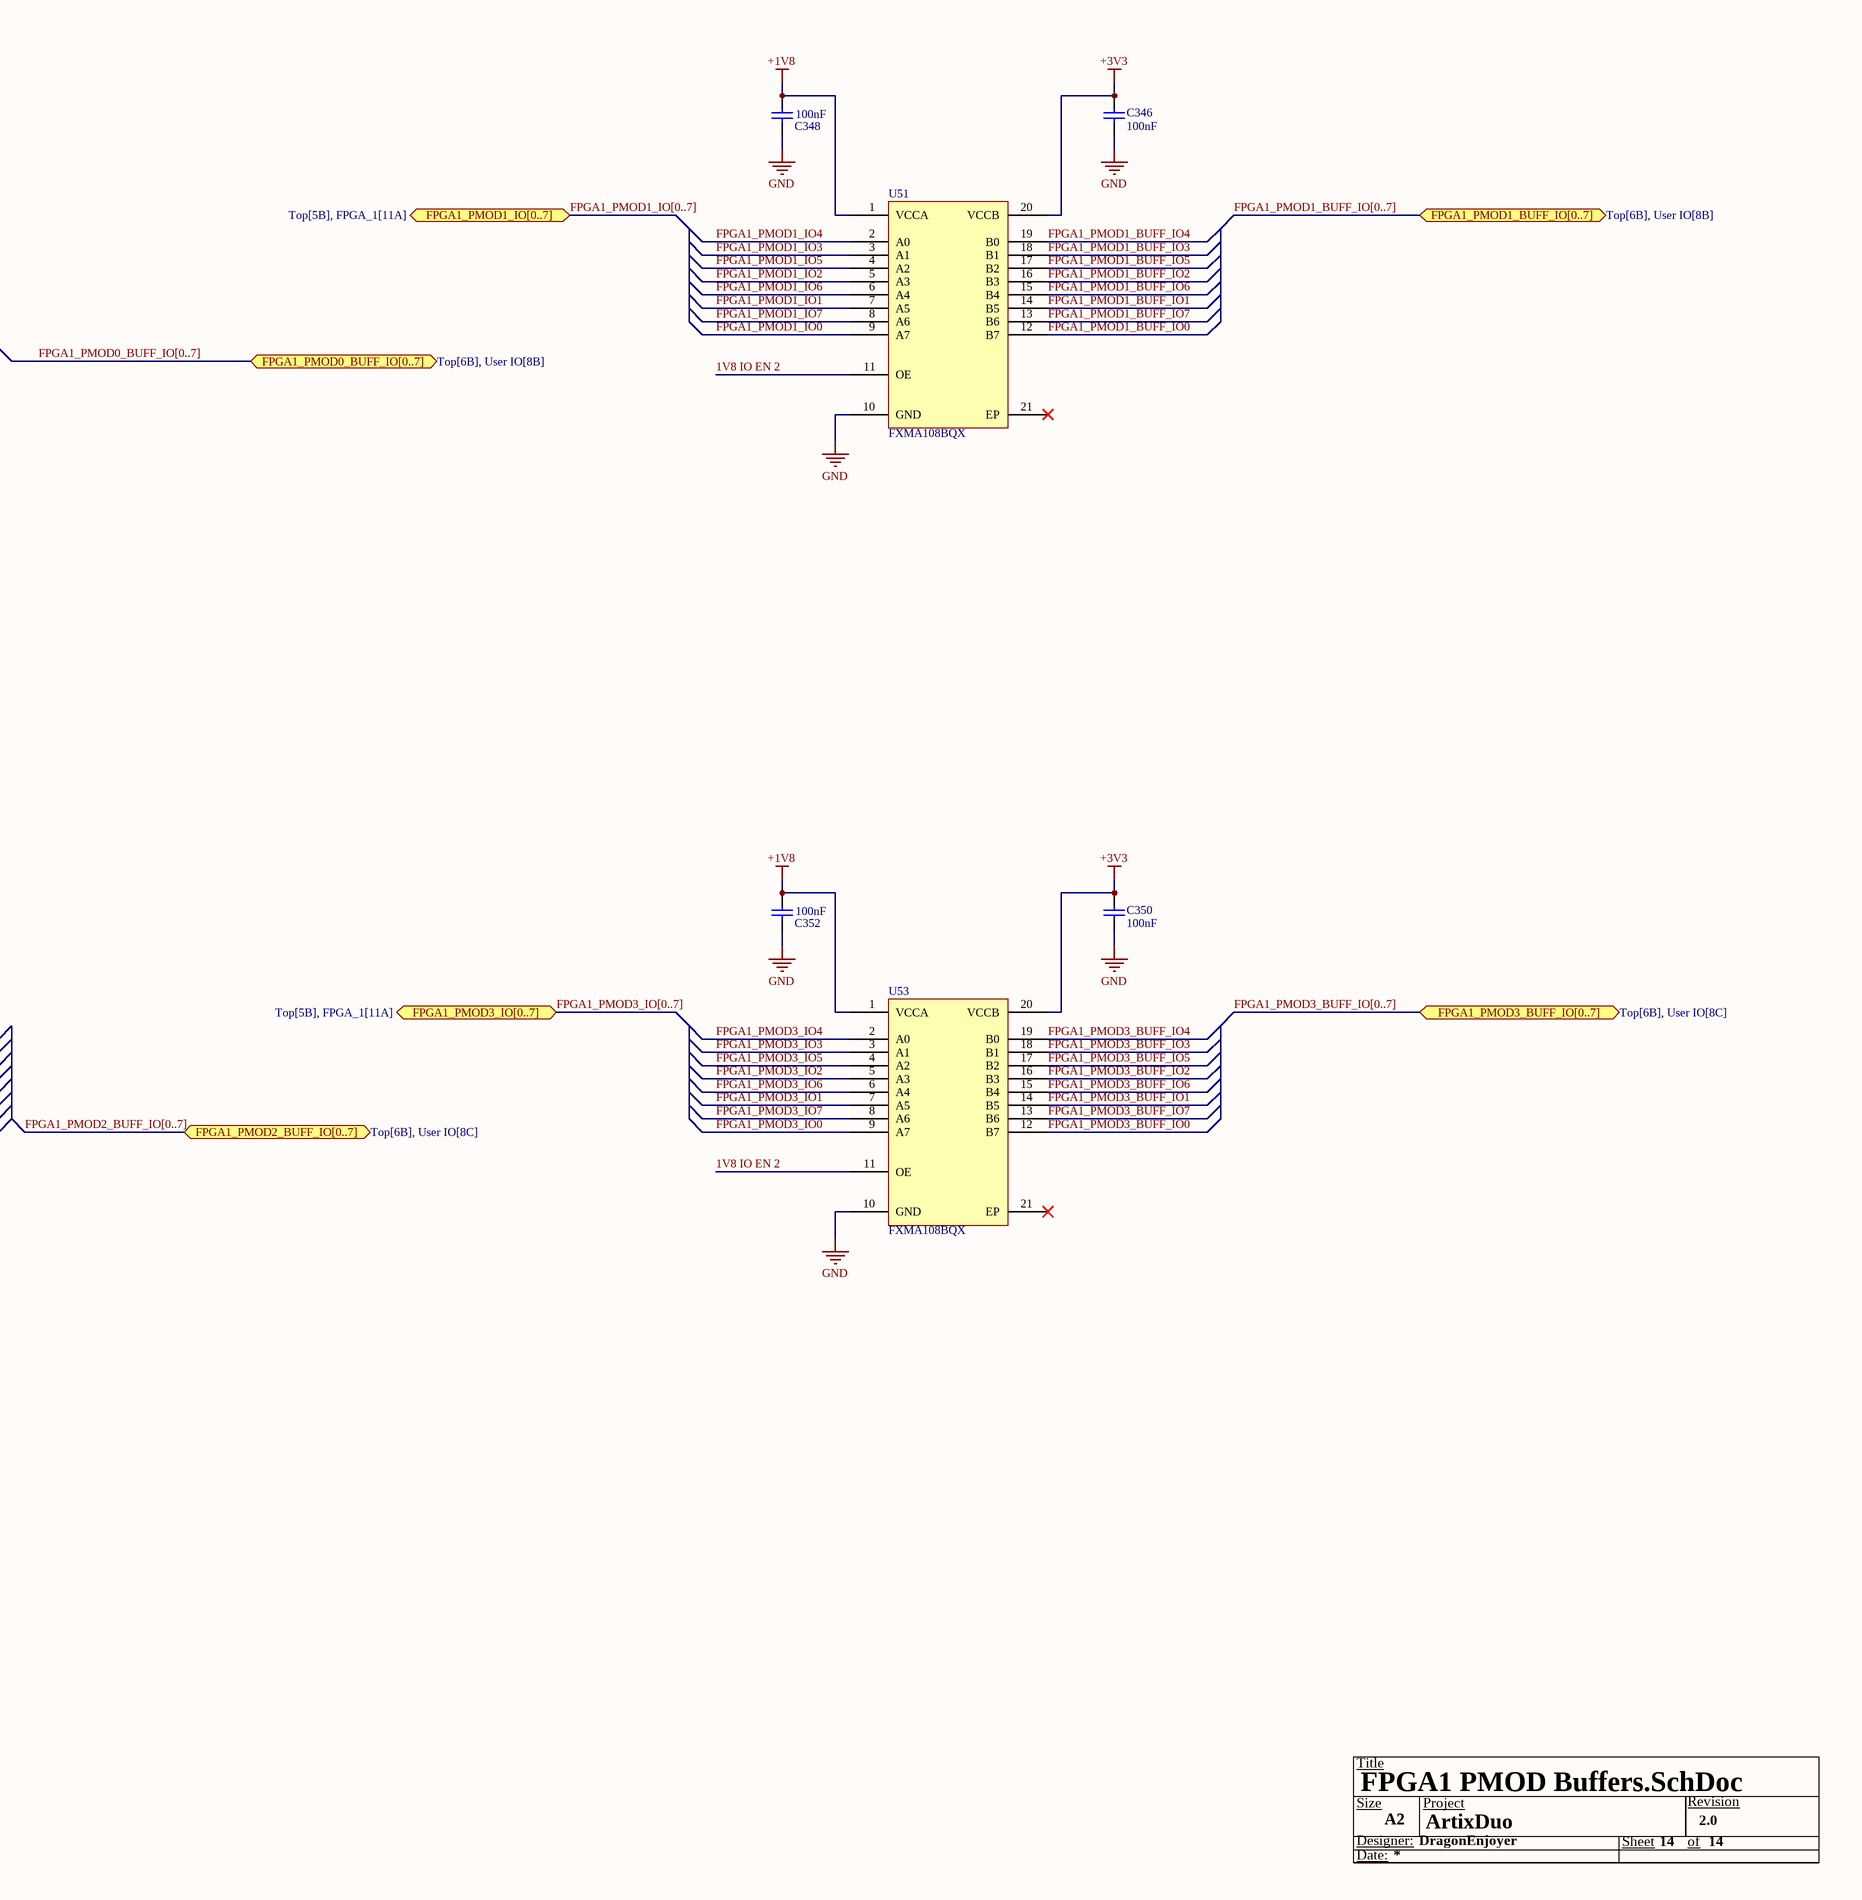
[diagram p37: FPGA1 PMOD Buffers.SchDoc, right]

### Parts
(Parts that share a designator on the sheet are numbered #1, #2 ... from top to bottom, then left to right.)
*#14  Size: A2  (hidden comment: Title Block)  (graphical)
C345  100nF  [CAPC1005X05N]
C346  100nF  [CAPC1005X05N]
C347  100nF  [CAPC1005X05N]
C348  100nF  [CAPC1005X05N]
C349  100nF  [CAPC1005X05N]
C350  100nF  [CAPC1005X05N]
C351  100nF  [CAPC1005X05N]
C352  100nF  [CAPC1005X05N]
C353  value 10uF  [CAPC1608X04N]  (hidden comment: GRM188R61E106MA73D)
Q23  2N7002-7-F  [FP-SOT23-MFG]
R104  3.3K  [RESC1005X40X25NL05T10]
R110  10K  [RESC1005X40X25NL05T10]
R111  10K  [RESC1005X40X25NL05T10]
U50  FXMA108BQX  [QFN50P450X250X80_HS-21N]
U51  FXMA108BQX  [QFN50P450X250X80_HS-21N]
U52  FXMA108BQX  [QFN50P450X250X80_HS-21N]
U53  FXMA108BQX  [QFN50P450X250X80_HS-21N]

### Ports
FPGA1_PMOD0_BUFF_IO[0..7] (bidir, see Top[6B], User IO[8B]), FPGA1_PMOD0_IO[0..7] (bidir, see Top[5B], FPGA_1[11A]), FPGA1_PMOD1_BUFF_IO[0..7] (bidir, see Top[6B], User IO[8B]), FPGA1_PMOD1_IO[0..7] (bidir, see Top[5B], FPGA_1[11A]), FPGA1_PMOD2_BUFF_IO[0..7] (bidir, see Top[6B], User IO[8C]), FPGA1_PMOD2_IO[0..7] (bidir, see Top[5B], FPGA_1[11A]), FPGA1_PMOD3_BUFF_IO[0..7] (bidir, see Top[6B], User IO[8C]), FPGA1_PMOD3_IO[0..7] (bidir, see Top[5B], FPGA_1[11A])

### Nets
+1V8: C347.2 C348.2 C351.2 C352.2 R104.2 U50.1(VCCA) U51.1(VCCA) U52.1(VCCA) U53.1(VCCA)
+3V3: C345.2 C346.2 C349.2 C350.2 U50.20(VCCB) U51.20(VCCB) U52.20(VCCB) U53.20(VCCB)
+5: R110.2 R111.1  [project net USB_5V0_AUX_IN]
GND: C345.1 C346.1 C347.1 C348.1 C349.1 C350.1 C351.1 C352.1 C353.1 Q23.2(S) R111.2 U50.10(GND) U51.10(GND) U52.10(GND) U53.10(GND)
1V8 IO EN 2: Q23.3(D) R104.1 U50.11(OE) U51.11(OE) U52.11(OE) U53.11(OE)
FPGA1_PMOD0_BUFF_IO0: U50.12(B7)
FPGA1_PMOD0_BUFF_IO1: U50.14(B5)
FPGA1_PMOD0_BUFF_IO2: U50.16(B3)
FPGA1_PMOD0_BUFF_IO3: U50.18(B1)
FPGA1_PMOD0_BUFF_IO4: U50.19(B0)
FPGA1_PMOD0_BUFF_IO5: U50.17(B2)
FPGA1_PMOD0_BUFF_IO6: U50.15(B4)
FPGA1_PMOD0_BUFF_IO7: U50.13(B6)
FPGA1_PMOD0_IO0: U50.9(A7)
FPGA1_PMOD0_IO1: U50.7(A5)
FPGA1_PMOD0_IO2: U50.5(A3)
FPGA1_PMOD0_IO3: U50.3(A1)
FPGA1_PMOD0_IO4: U50.2(A0)
FPGA1_PMOD0_IO5: U50.4(A2)
FPGA1_PMOD0_IO6: U50.6(A4)
FPGA1_PMOD0_IO7: U50.8(A6)
FPGA1_PMOD1_BUFF_IO0: U51.12(B7)
FPGA1_PMOD1_BUFF_IO1: U51.14(B5)
FPGA1_PMOD1_BUFF_IO2: U51.16(B3)
FPGA1_PMOD1_BUFF_IO3: U51.18(B1)
FPGA1_PMOD1_BUFF_IO4: U51.19(B0)
FPGA1_PMOD1_BUFF_IO5: U51.17(B2)
FPGA1_PMOD1_BUFF_IO6: U51.15(B4)
FPGA1_PMOD1_BUFF_IO7: U51.13(B6)
FPGA1_PMOD1_IO0: U51.9(A7)
FPGA1_PMOD1_IO1: U51.7(A5)
FPGA1_PMOD1_IO2: U51.5(A3)
FPGA1_PMOD1_IO3: U51.3(A1)
FPGA1_PMOD1_IO4: U51.2(A0)
FPGA1_PMOD1_IO5: U51.4(A2)
FPGA1_PMOD1_IO6: U51.6(A4)
FPGA1_PMOD1_IO7: U51.8(A6)
FPGA1_PMOD2_BUFF_IO0: U52.12(B7)
FPGA1_PMOD2_BUFF_IO1: U52.14(B5)
FPGA1_PMOD2_BUFF_IO2: U52.16(B3)
FPGA1_PMOD2_BUFF_IO3: U52.18(B1)
FPGA1_PMOD2_BUFF_IO4: U52.19(B0)
FPGA1_PMOD2_BUFF_IO5: U52.17(B2)
FPGA1_PMOD2_BUFF_IO6: U52.15(B4)
FPGA1_PMOD2_BUFF_IO7: U52.13(B6)
FPGA1_PMOD2_IO0: U52.9(A7)
FPGA1_PMOD2_IO1: U52.7(A5)
FPGA1_PMOD2_IO2: U52.5(A3)
FPGA1_PMOD2_IO3: U52.3(A1)
FPGA1_PMOD2_IO4: U52.2(A0)
FPGA1_PMOD2_IO5: U52.4(A2)
FPGA1_PMOD2_IO6: U52.6(A4)
FPGA1_PMOD2_IO7: U52.8(A6)
FPGA1_PMOD3_BUFF_IO0: U53.12(B7)
FPGA1_PMOD3_BUFF_IO1: U53.14(B5)
FPGA1_PMOD3_BUFF_IO2: U53.16(B3)
FPGA1_PMOD3_BUFF_IO3: U53.18(B1)
FPGA1_PMOD3_BUFF_IO4: U53.19(B0)
FPGA1_PMOD3_BUFF_IO5: U53.17(B2)
FPGA1_PMOD3_BUFF_IO6: U53.15(B4)
FPGA1_PMOD3_BUFF_IO7: U53.13(B6)
FPGA1_PMOD3_IO0: U53.9(A7)
FPGA1_PMOD3_IO1: U53.7(A5)
FPGA1_PMOD3_IO2: U53.5(A3)
FPGA1_PMOD3_IO3: U53.3(A1)
FPGA1_PMOD3_IO4: U53.2(A0)
FPGA1_PMOD3_IO5: U53.4(A2)
FPGA1_PMOD3_IO6: U53.6(A4)
FPGA1_PMOD3_IO7: U53.8(A6)
NetC353_2: C353.2 Q23.1(G) R110.1

Not connected (* = marked no-connect by the designer): U50 21(EP)*; U51 21(EP)*; U52 21(EP)*; U53 21(EP)*

### Buses and harness runs
bus FPGA1_PMOD0_BUFF_IO[0..7] = port FPGA1_PMOD0_BUFF_IO[0..7]
bus FPGA1_PMOD0_IO[0..7] = port FPGA1_PMOD0_IO[0..7]
bus FPGA1_PMOD1_BUFF_IO[0..7] = port FPGA1_PMOD1_BUFF_IO[0..7]
bus FPGA1_PMOD1_IO[0..7] = port FPGA1_PMOD1_IO[0..7]
bus FPGA1_PMOD2_BUFF_IO[0..7] = port FPGA1_PMOD2_BUFF_IO[0..7]
bus FPGA1_PMOD2_IO[0..7] = port FPGA1_PMOD2_IO[0..7]
bus FPGA1_PMOD3_BUFF_IO[0..7] = port FPGA1_PMOD3_BUFF_IO[0..7]
bus FPGA1_PMOD3_IO[0..7] = port FPGA1_PMOD3_IO[0..7]

### Notes on the sheet
- (in symbol CMP-007-000006-8) Title; Size; Project; Revision; Designer:; Sheet; of; Date:

### Library data of the parts
*#14 = CMP-007-000006-8: Generic Title Block
C345-C352 = CMP-001-00095-1: as C288-C307 on sheet High Speed User IO; Voltage: 50V; Capacitance: 100nF; Case: 0402
C353 = CMP-001-00096-1: as C340 on sheet User IO Buffers; Dielectric: X5R; Case/Package: 0603; Voltage: 25V
Q23 = CMP-2000-04929-2: as Q21 on sheet User IO Buffers; Termination: SMD/SMT; Weight: 0.000282oz; Radiation Hardening: No; Max Operating Temperature: 150°C; On-State Resistance: 7.5R; Mount: Surface Mount; Current Rating: 115mA; Contact Plating: Tin; Lead Free: Lead Free; Min Operating Temperature: -55°C; Number of Pins: 3; REACH SVHC: No SVHC; Drain to Source Voltage (Vdss): 60V; Width: 1.3mm; Package Quantity: 3000; Length: 2.9mm; Case/Package: SOT-23; Number of Channels: 1; Dual Supply Voltage: 60V; Packaging: Tape and Reel; Height: 1mm; Voltage Rating (DC): 60V; Nominal Vgs: 2.5V; Continuous Drain Current (ID): 115mA; Voltage: 60V; Rds On Max: 7.5R
R104 = CMP-2002-03055-1: as R273 on sheet User IO Buffers; Part Number: CRCW04023K30FKEDHP
R110 R111 = CMP-2002-07353-1: as R275-R278 on sheet User IO Buffers; Part Number: RC0402FR-0710KL
U50-U53 = CMP-015-00018-1: as U34 on sheet User IO Buffers; Logic Function: Translator; Case/Package: QFN